# Altium project SmartHub Carrier.PrjPcb (part 1 of 2)
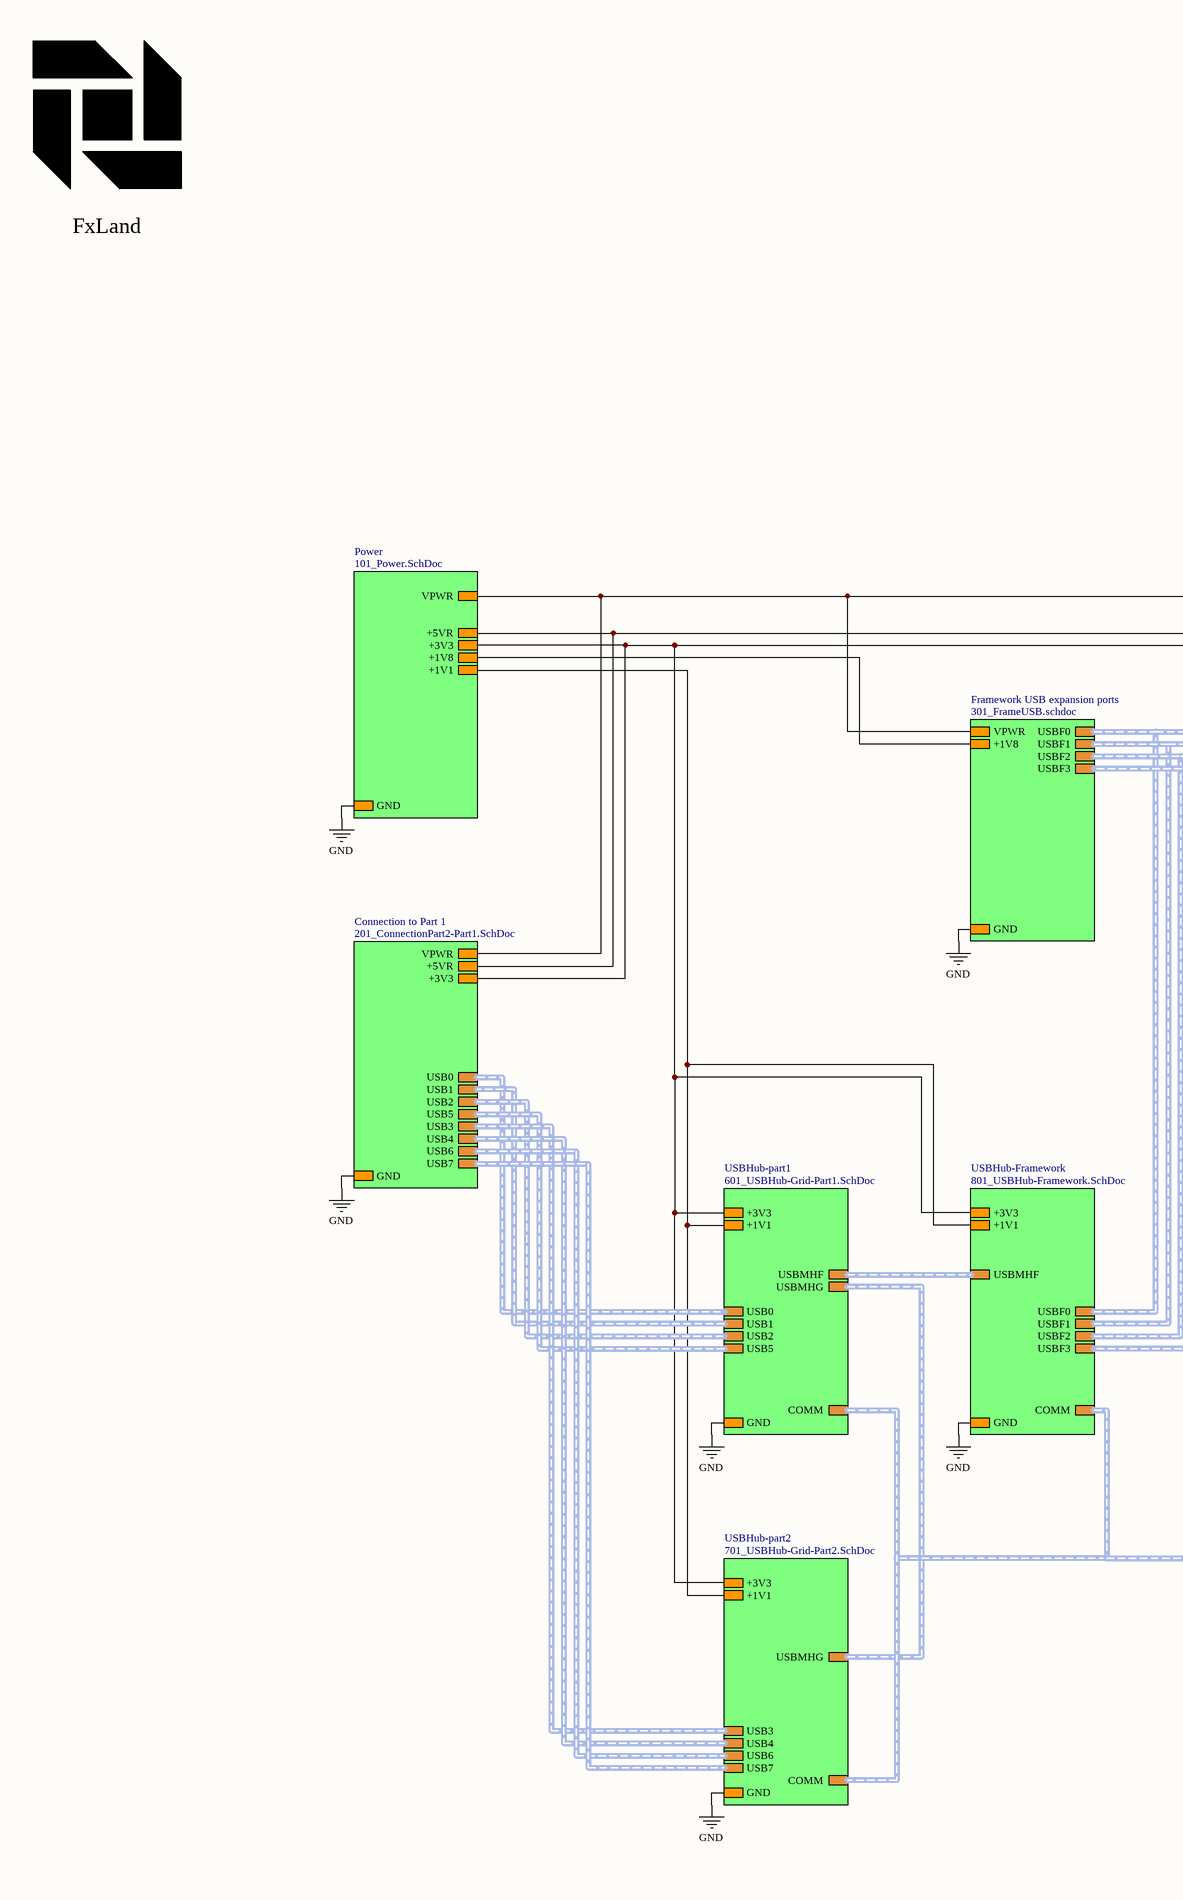
[diagram p0: 001_OverViewMainHub-part2.SchDoc, left]
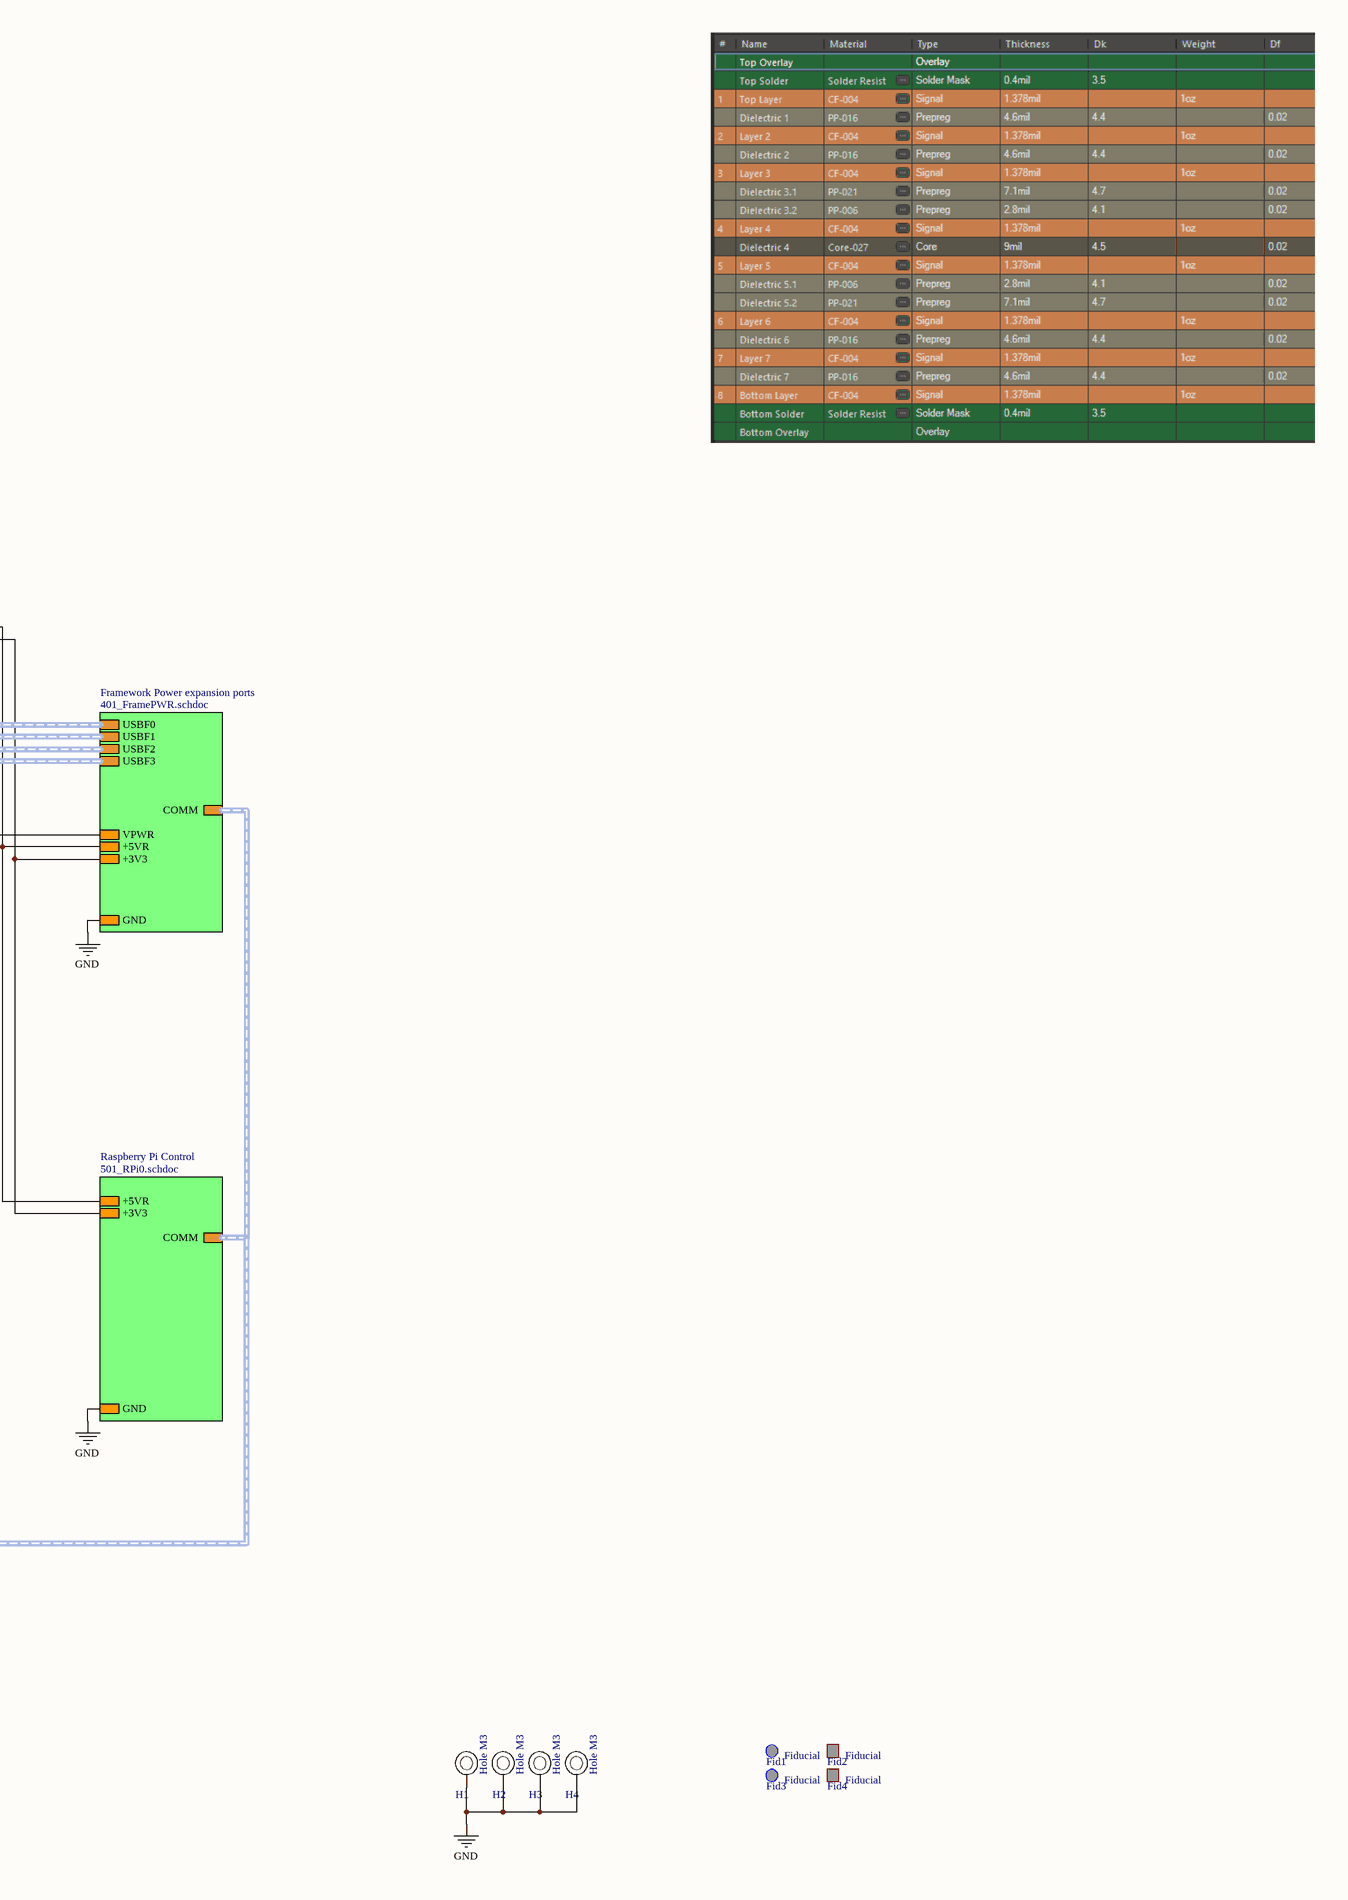
[diagram p1: 001_OverViewMainHub-part2.SchDoc, right]
DocNumber: P234; PrName: Blox MainHub Part 2; Rev: 0.6
9 sheets, 460 parts. Net scope: hierarchical (ports join the sheet entries above them; power ports are global).
Board file: SmartHub Carrier.PcbDoc
Sheets:
  001_OverViewMainHub-part2.SchDoc
    Power = 101_Power.SchDoc
    Framework USB expansion ports = 301_FrameUSB.SchDoc
    Raspberry Pi Control = 501_RPi0.SchDoc
    Framework Power expansion ports = 401_FramePWR.schdoc
    Connection to Part 1 = 201_ConnectionPart2-Part1.SchDoc
    USBHub-part1 = 601_USBHub-Grid-Part1.SchDoc
    USBHub-Framework = 801_USBHub-Framework.SchDoc
    USBHub-part2 = 701_USBHub-Grid-Part2.SchDoc

## Sheet 001_OverViewMainHub-part2.SchDoc: Overview BAS Main Hub
size A2; Organization: Greenfield Tech Solutions; Address1: Molendreef 33; Address2: Ossendrecht; Address3: 4641CS; Address4: The Netherlands; DocumentNumber: P234; Revision: 0.6; SheetNumber: 1; SheetTotal: 9

### Parts
Fid1  Fiducial  [FidR_1.0mm]
Fid2  Fiducial  [FidS_1.0mm]
Fid3  Fiducial  [FidR_1.0mm]
Fid4  Fiducial  [FidS_1.0mm]
H1  Hole M3  [HOLE_M3]
H2  Hole M3  [HOLE_M3]
H3  Hole M3  [HOLE_M3]
H4  Hole M3  [HOLE_M3]
Logo_FxLand  FxLand  [Logo_FxLand_3]  (value not drawn)

### Sub-sheets
Connection to Part 1 = 201_ConnectionPart2-Part1.SchDoc: GND, VPWR, +5VR, +3V3, USB0, USB1, USB2, USB5, USB3, USB4, USB6, USB7
Framework Power expansion ports = 401_FramePWR.schdoc: GND, VPWR, +5VR, USBF0, USBF1, USBF2, USBF3, +3V3, COMM
Framework USB expansion ports = 301_FrameUSB.schdoc: GND, VPWR, USBF0, USBF1, USBF2, USBF3, +1V8
Power = 101_Power.SchDoc: GND, VPWR, +5VR, +3V3, +1V1, +1V8
Raspberry Pi Control = 501_RPi0.schdoc: GND, +5VR, COMM, +3V3
USBHub-Framework = 801_USBHub-Framework.SchDoc: GND, USBF0, USBF1, USBF2, USBF3, USBMHF, COMM, +1V1, +3V3
USBHub-part1 = 601_USBHub-Grid-Part1.SchDoc: GND, USB0, USB1, USB2, USB5, USBMHF, USBMHG, COMM, +1V1, +3V3
USBHub-part2 = 701_USBHub-Grid-Part2.SchDoc: GND, USBMHG, USB3, USB4, USB6, USB7, COMM, +1V1, +3V3

### Nets
+1V1: sheet Power/+1V1, sheet USBHub-part1/+1V1, sheet USBHub-Framework/+1V1, sheet USBHub-part2/+1V1
+1V8: sheet Power/+1V8, sheet Framework USB expansion ports/+1V8
+3V3: sheet Power/+3V3, sheet Raspberry Pi Control/+3V3, sheet Framework Power expansion ports/+3V3, sheet Connection to Part 1/+3V3, sheet USBHub-part1/+3V3, sheet USBHub-Framework/+3V3, sheet USBHub-part2/+3V3
+5VR: sheet Power/+5VR, sheet Raspberry Pi Control/+5VR, sheet Framework Power expansion ports/+5VR, sheet Connection to Part 1/+5VR
GND: H1.1 H2.1 H3.1 H4.1 ; sheet Power/GND, sheet Framework USB expansion ports/GND, sheet Raspberry Pi Control/GND, sheet Framework Power expansion ports/GND, sheet Connection to Part 1/GND, sheet USBHub-part1/GND, sheet USBHub-Framework/GND, sheet USBHub-part2/GND
VPWR: sheet Power/VPWR, sheet Framework USB expansion ports/VPWR, sheet Framework Power expansion ports/VPWR, sheet Connection to Part 1/VPWR

### Buses and harness runs
harness sheet Connection to Part 1/USB0 = sheet USBHub-part1/USB0
harness sheet Connection to Part 1/USB1 = sheet USBHub-part1/USB1
harness sheet Connection to Part 1/USB2 = sheet USBHub-part1/USB2
harness sheet Connection to Part 1/USB3 = sheet USBHub-part2/USB3
harness sheet Connection to Part 1/USB4 = sheet USBHub-part2/USB4
harness sheet Connection to Part 1/USB5 = sheet USBHub-part1/USB5
harness sheet Connection to Part 1/USB6 = sheet USBHub-part2/USB6
harness sheet Connection to Part 1/USB7 = sheet USBHub-part2/USB7
harness sheet Framework Power expansion ports/COMM = sheet Raspberry Pi Control/COMM = sheet USBHub-Framework/COMM = sheet USBHub-part1/COMM = sheet USBHub-part2/COMM
harness sheet Framework Power expansion ports/USBF0 = sheet Framework USB expansion ports/USBF0 = sheet USBHub-Framework/USBF0
harness sheet Framework Power expansion ports/USBF1 = sheet Framework USB expansion ports/USBF1 = sheet USBHub-Framework/USBF1
harness sheet Framework Power expansion ports/USBF2 = sheet Framework USB expansion ports/USBF2 = sheet USBHub-Framework/USBF2
harness sheet Framework Power expansion ports/USBF3 = sheet Framework USB expansion ports/USBF3 = sheet USBHub-Framework/USBF3
harness sheet USBHub-Framework/USBMHF = sheet USBHub-part1/USBMHF
harness sheet USBHub-part1/USBMHG = sheet USBHub-part2/USBMHG

### Notes on the sheet
- Title
- Size:
- Date:
- File:
- A2
- Number:
- Time:
- Revision:
- Sheet
- of

### Library data of the parts
Fid1 Fid3 = ME0011: Fiducial Round 1mm; Part Number: ME0011; ID: 11; RefVal: Fiducial
Fid2 Fid4 = ME0012: Fiducial Sqaure 1mm; Part Number: ME0012; ID: 12; RefVal: Fiducial
H1-H4 = ME0001: Mounting Hole M3; Part Number: ME0001; ID: 1; RefVal: Hole M3
Logo_FxLand = ME0008: Logo FxLand 3; Part Number: ME0008; ID: 8; RefVal: FxLand

## Sheet 101_Power.SchDoc: Power MainHub Part 2
size A2; Organization: Greenfield Tech Solutions; Address1: Molendreef 33; Address2: Ossendrecht; Address3: 4641CS; Address4: The Netherlands; DocumentNumber: P234; Revision: 0.6; SheetNumber: 2; SheetTotal: 9
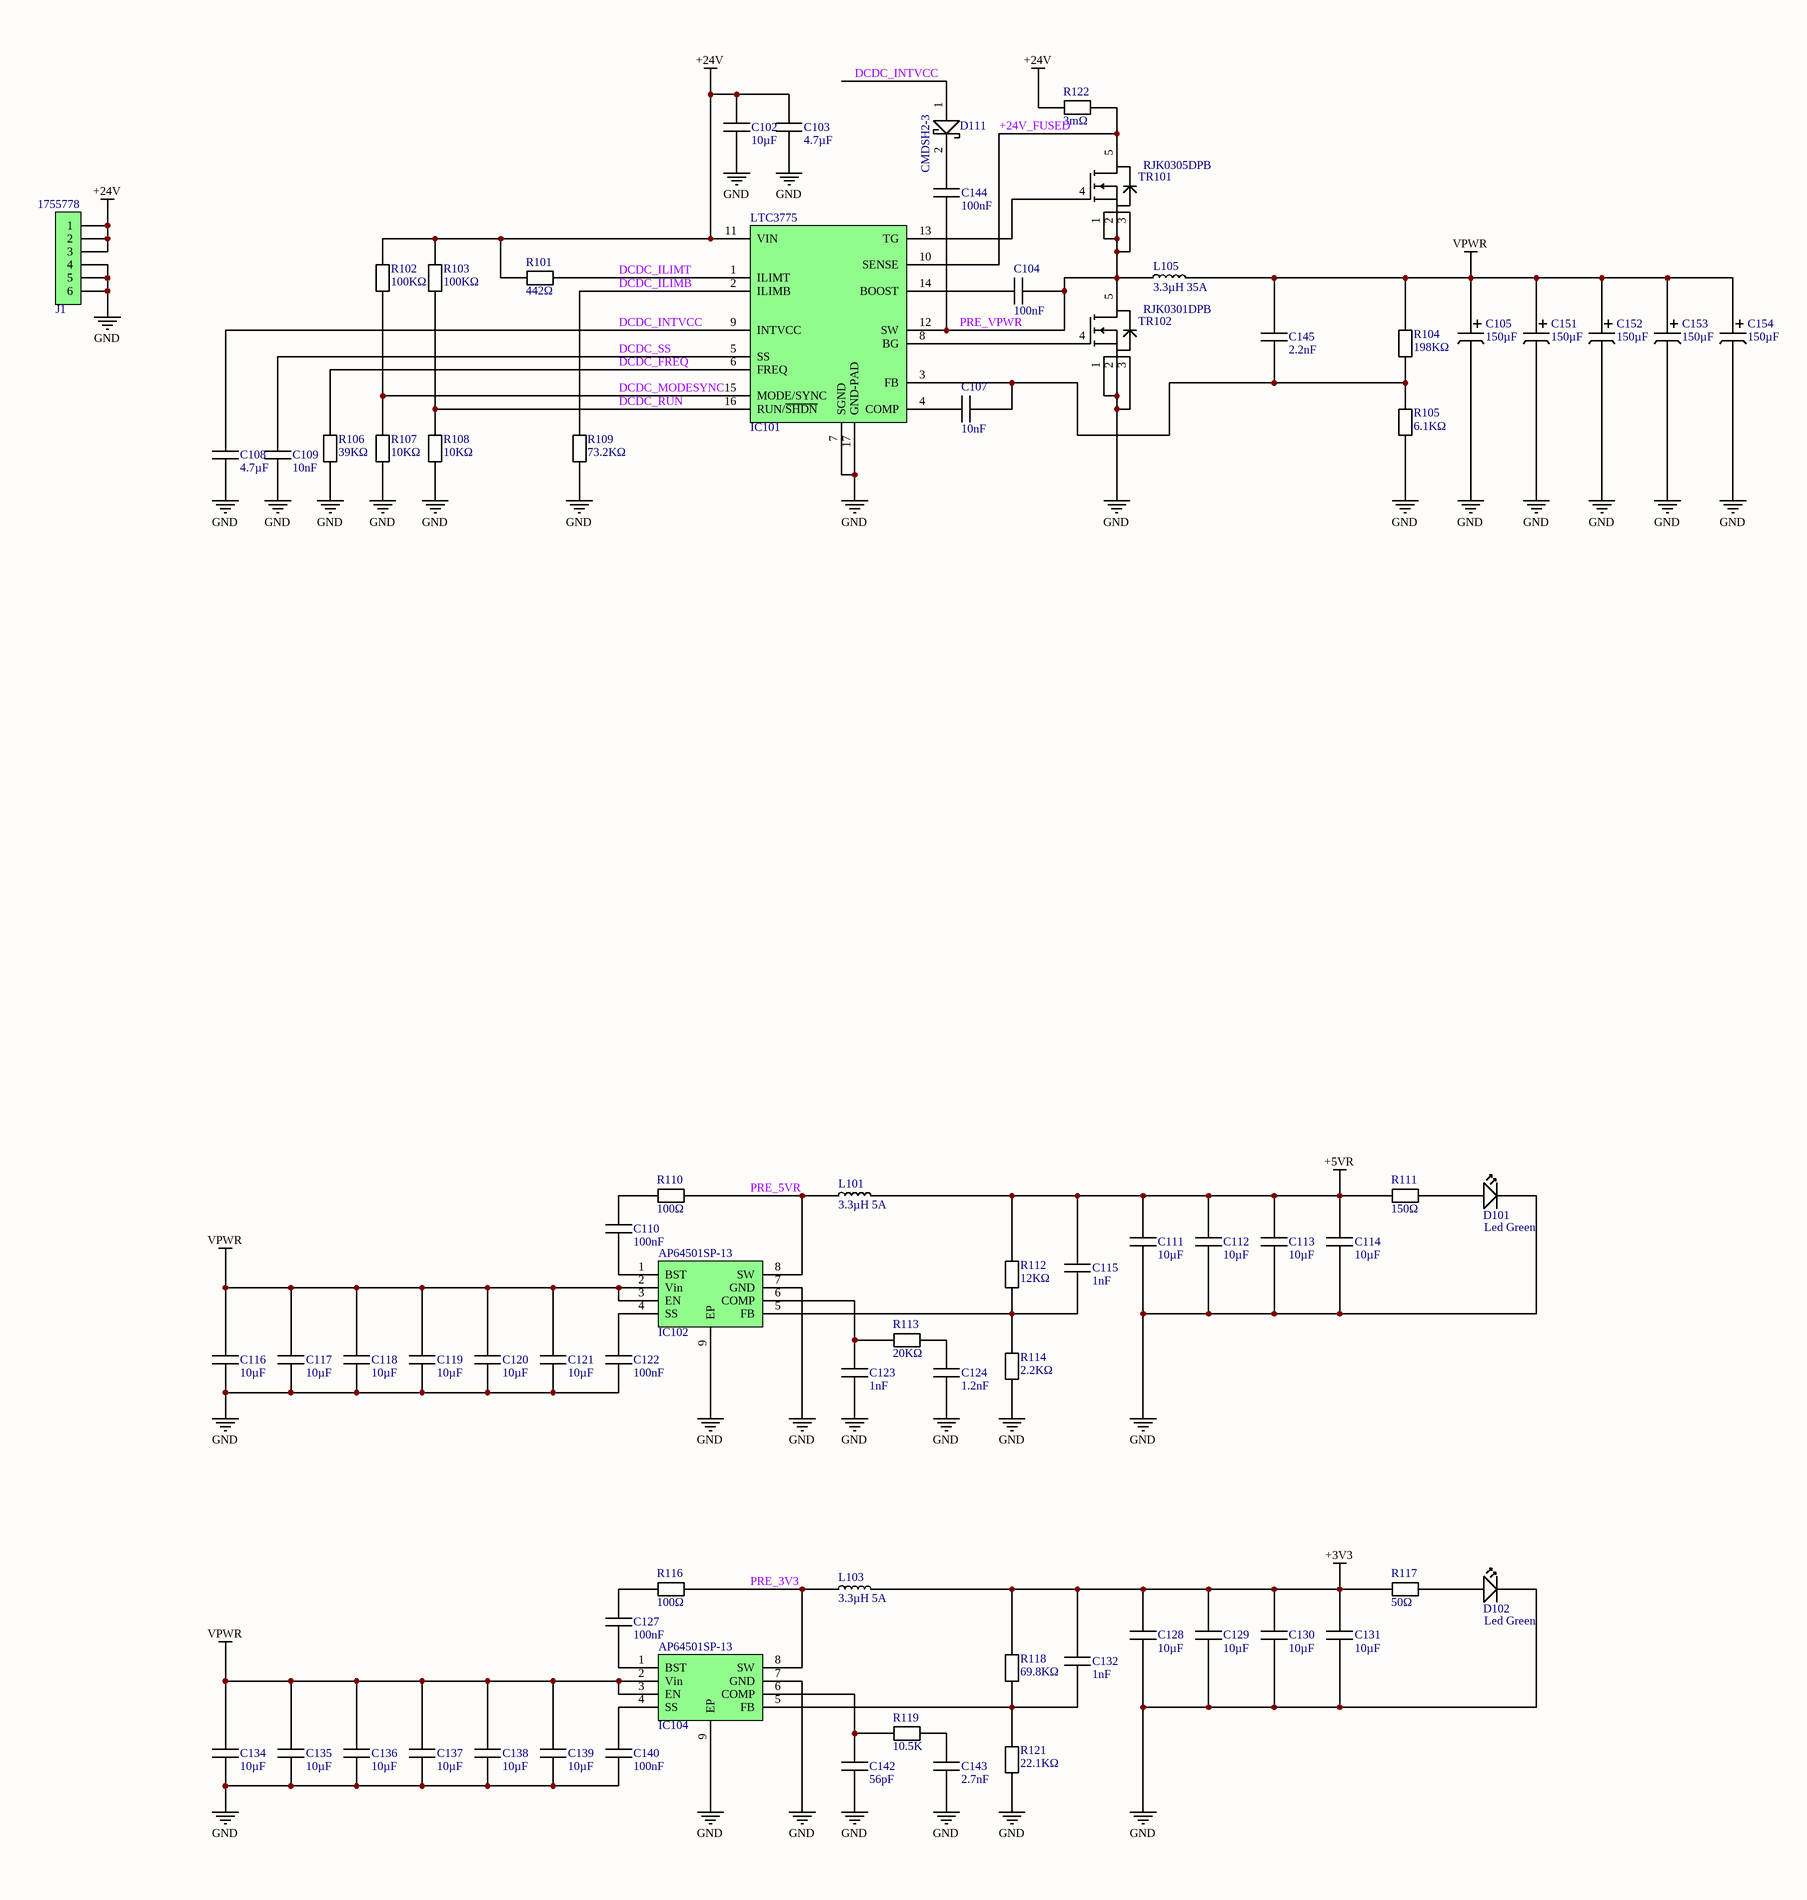
[diagram p2: 101_Power.SchDoc, left]
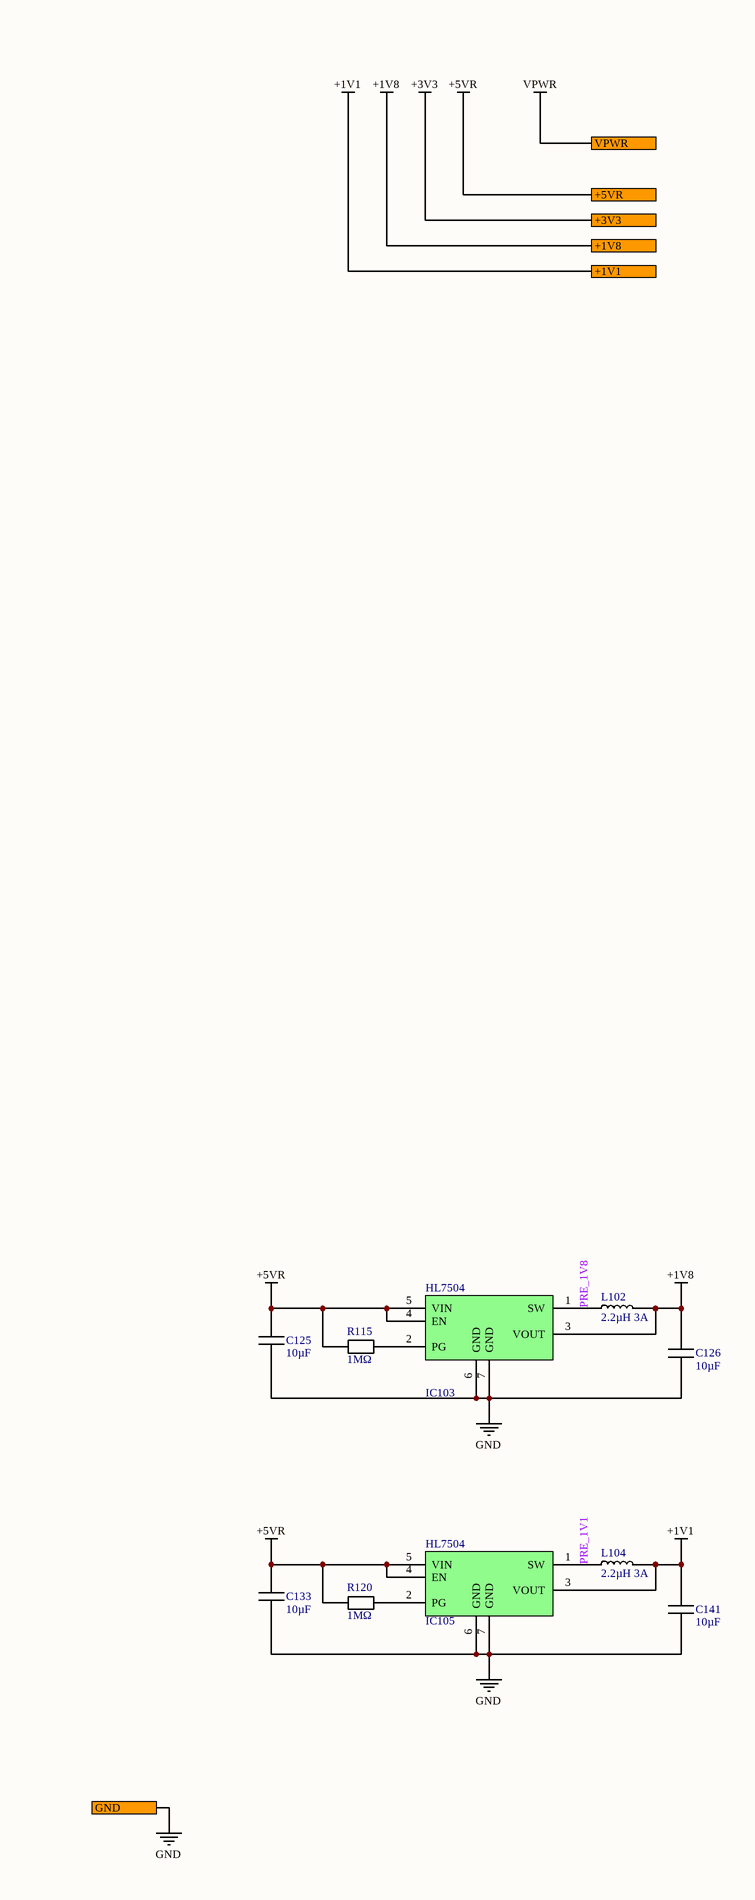
[diagram p3: 101_Power.SchDoc, right]

### Parts
C102  10µF  [C1210]
C103  4.7µF  [C1210]
C104  100nF  [C0402]
C105  150µF  [Tantalum_2924_4.1MM]
C107  10nF  [C0805]
C108  4.7µF  [C1210]
C109  10nF  [C0805]
C110  100nF  [C0402]
C111  10µF  [C0805]
C112  10µF  [C0805]
C113  10µF  [C0805]
C114  10µF  [C0805]
C115  1nF  [C0402]
C116  10µF  [C0805]
C117  10µF  [C0805]
C118  10µF  [C0805]
C119  10µF  [C0805]
C120  10µF  [C0805]
C121  10µF  [C0805]
C122  100nF  [C0402]
C123  1nF  [C0402]
C124  1.2nF  [C0402]
C125  10µF  [C0603]
C126  10µF  [C0603]
C127  100nF  [C0402]
C128  10µF  [C0805]
C129  10µF  [C0805]
C130  10µF  [C0805]
C131  10µF  [C0805]
C132  1nF  [C0402]
C133  10µF  [C0603]
C134  10µF  [C0805]
C135  10µF  [C0805]
C136  10µF  [C0805]
C137  10µF  [C0805]
C138  10µF  [C0805]
C139  10µF  [C0805]
C140  100nF  [C0402]
C141  10µF  [C0603]
C142  56pF  [C0402]
C143  2.7nF  [C0402]
C144  100nF  [C0402]
C145  2.2nF  [C0805]
C151  150µF  [Tantalum_2924_4.1MM]
C152  150µF  [Tantalum_2924_4.1MM]
C153  150µF  [Tantalum_2924_4.1MM]
C154  150µF  [Tantalum_2924_4.1MM]
D101  Led Green  [Led0805]
D102  Led Green  [Led0805]
D111  CMDSH2-3  [SOD-323]
IC101  LTC3775  [QFN-16G_3X3]
IC102  AP64501SP-13  [SO-8-EP]
IC103  HL7504  [DFN-6G_2X2]
IC104  AP64501SP-13  [SO-8-EP]
IC105  HL7504  [DFN-6G_2X2]
J1  1755778  [1755778]
L101  3.3µH 5A  [SRN6045TA]
L102  2.2µH 3A  [NRS4018]
L103  3.3µH 5A  [SRN6045TA]
L104  2.2µH 3A  [NRS4018]
L105  3.3µH 35A  [IN-2P_17X17]
R101  442Ω  [R0402]
R102  100KΩ  [R0402]
R103  100KΩ  [R0402]
R104  198KΩ  [R0603]
R105  6.1KΩ  [R0402]
R106  39KΩ  [R0402]
R107  10KΩ  [R0402]
R108  10KΩ  [R0402]
R109  73.2KΩ  [R0402]
R110  100Ω  [R0603]
R111  150Ω  [R0603]
R112  12KΩ  [R0402]
R113  20KΩ  [R0402]
R114  2.2KΩ  [R0402]
R115  1MΩ  [R0402]
R116  100Ω  [R0603]
R117  50Ω  [R0603]
R118  69.8KΩ  [R0603]
R119  10.5K  [R0402]
R120  1MΩ  [R0402]
R121  22.1KΩ  [R0603]
R122  3mΩ  [R1206]
TR101  RJK0305DPB  [LFPAK-5_4.9X4]
TR102  RJK0301DPB  [LFPAK-5_4.9X4]

### Ports
+1V1, +1V8, +3V3, +5VR, GND, VPWR

### Nets
+1V1: C141.1 IC105.3(VOUT) L104.2 ; port +1V1
+1V8: C126.1 IC103.3(VOUT) L102.2 ; port +1V8
+3V3: C128.1 C129.1 C130.1 C131.1 C132.1 L103.2 R117.1 R118.2 ; port +3V3
+5VR: C111.1 C112.1 C113.1 C114.1 C115.1 C125.1 C133.1 IC103.4(EN) IC103.5(VIN) IC105.4(EN) IC105.5(VIN) L101.2 R111.1 R112.2 R115.1 R120.1 ; port +5VR
+24V: C102.1 C103.1 IC101.11(VIN) J1.1 J1.2 J1.3 R101.2 R102.2 R103.2 R122.1
GND: C102.2 C103.2 C105.2 C108.2 C109.2 C111.2 C112.2 C113.2 C114.2 C116.2 C117.2 C118.2 C119.2 C120.2 C121.2 C122.2 C123.2 C124.2 C125.2 C126.2 C128.2 C129.2 C130.2 C131.2 C133.2 C134.2 C135.2 C136.2 C137.2 C138.2 C139.2 C140.2 C141.2 C142.2 C143.2 C151.2 C152.2 C153.2 C154.2 D101.K D102.K IC101.7(SGND) IC101.17(GND-PAD) IC102.7(GND) IC102.9(EP) IC103.6(GND) IC103.7(GND) IC104.7(GND) IC104.9(EP) IC105.6(GND) IC105.7(GND) J1.4 J1.5 J1.6 R105.1 R106.1 R107.1 R108.1 R109.1 R114.1 R121.1 TR102.1(S) TR102.2(S) TR102.3(S) ; port GND
VPWR: C105.1 C116.1 C117.1 C118.1 C119.1 C120.1 C121.1 C134.1 C135.1 C136.1 C137.1 C138.1 C139.1 C145.1 C151.1 C152.1 C153.1 C154.1 IC102.2(Vin) IC102.3(EN) IC104.2(Vin) IC104.3(EN) L105.2 R104.2 ; port VPWR
+24V_FUSED: IC101.10(SENSE) R122.2 TR101.5(D)
DCDC_FREQ: IC101.6(FREQ) R106.2
DCDC_ILIMB: IC101.2(ILIMB) R109.2
DCDC_ILIMT: IC101.1(ILIMT) R101.1
DCDC_INTVCC: C108.1 D111.1(A) IC101.9(INTVCC)
DCDC_MODESYNC: IC101.15(MODE/SYNC) R102.1 R107.2
DCDC_RUN: IC101.16(RUN/~{SHDN}) R103.1 R108.2
DCDC_SS: C109.1 IC101.5(SS)
PRE_1V1: IC105.1(SW) L104.1
PRE_1V8: IC103.1(SW) L102.1
PRE_3V3: IC104.8(SW) L103.1 R116.2
PRE_5VR: IC102.8(SW) L101.1 R110.2
PRE_VPWR: C104.2 C144.2 IC101.12(SW) L105.1 TR101.1(S) TR101.2(S) TR101.3(S) TR102.5(D)
NetC104_1: C104.1 IC101.14(BOOST)
NetC107_1: C107.1 IC101.4(COMP)
NetC107_2: C107.2 C145.2 IC101.3(FB) R104.1 R105.2
NetC110_1: C110.1 R110.1
NetC110_2: C110.2 IC102.1(BST)
NetC115_2: C115.2 IC102.5(FB) R112.1 R114.2
NetC122_1: C122.1 IC102.4(SS)
NetC123_1: C123.1 IC102.6(COMP) R113.2
NetC124_1: C124.1 R113.1
NetC127_1: C127.1 R116.1
NetC127_2: C127.2 IC104.1(BST)
NetC132_2: C132.2 IC104.5(FB) R118.1 R121.2
NetC140_1: C140.1 IC104.4(SS)
NetC142_1: C142.1 IC104.6(COMP) R119.2
NetC143_1: C143.1 R119.1
NetC144_1: C144.1 D111.2(K)
NetD101_A: D101.A R111.2
NetD102_A: D102.A R117.2
NetIC101_8: IC101.8(BG) TR102.4(G)
NetIC101_13: IC101.13(TG) TR101.4(G)
NetIC103_2: IC103.2(PG) R115.2
NetIC105_2: IC105.2(PG) R120.2

### Notes on the sheet
- Title
- Size:
- Date:
- File:
- A2
- Number:
- Time:
- Revision:
- Sheet
- of

### Library data of the parts
C102 = CA0024: 10µF 63V 10% X7R; Part Number: CA0024; ManfactPart: GRM32ER71J106KA12; ID: 24; RefVal: 10µF
C103 C108 = CA0038: 4.7µF 100V 10% X5R; Part Number: CA0038; ManfactPart: HMK325BJ475KM-PE; ID: 38; RefVal: 4.7µF
C104 C110 C122 C127 C140 C144 = CA0029: 100nF 50V 10% X7R; Part Number: CA0029; ManfactPart: CGA2B3X7R1H104K050BB; ID: 29; RefVal: 100nF
C105 C151-C154 = CA0076: 150µF 35V 20% 100mΩ; Part Number: CA0076; ManfactPart: TCJU157M035R0100E; ID: 76; RefVal: 150µF
C107 C109 = CA0021: 10nF 50V 10% X7R; Part Number: CA0021; ManfactPart: C0805C103K5RAC; ID: 21; RefVal: 10nF
C111-C114 C128-C131 = CA0001: 10µF 16V 10% X5R; Part Number: CA0001; ManfactPart: GRM21BR61C106KE15L; ID: 1; RefVal: 10µF
C115 C123 C132 = CA0031: 1nF 50V 1% C0G; Part Number: CA0031; ManfactPart: GRT1555C1H102FA02D; ID: 31; RefVal: 1nF
C116-C121 C134-C139 = CA0005: 10µF 35V 10% X5R; Part Number: CA0005; ManfactPart: C2012X5R1V106K125AC; ID: 5; RefVal: 10µF
C124 = CA0030: 1.2nF 50V 10% X7R; Part Number: CA0030; ManfactPart: GCM155R71H122KA37D; ID: 30; RefVal: 1.2nF
C125 C126 C133 C141 = CA0008: 10µF 16V 20% X5R; Part Number: CA0008; ManfactPart: GRM188R61C106MAALD; ID: 8; RefVal: 10µF
C142 = CA0068: 56pF 50V 2% C0G; Part Number: CA0068; ManfactPart: CC0402GRNPO9BN560; ID: 68; RefVal: 56pF
C143 = CA0055: 2.7nF 50V 5% X7R; Part Number: CA0055; ManfactPart: GRM155R71H272JA01D; ID: 55; RefVal: 2.7nF
C145 = CA0070: 2.2nF 50V 10% X7R; Part Number: CA0070; ManfactPart: C0805C222K5RAC; ID: 70; RefVal: 2.2nF
D101 D102 = DI0001: Part Number: DI0001; ManfactPart: KP-2012CGCK; ID: 1; RefVal: Led Green
D111 = DI0013: Schottky Diodes 30V; Part Number: DI0013; ManfactPart: CMDSH2-3 TR PBFREE; ID: 13; RefVal: CMDSH2-3
IC101 = IC0063: High Frequency Synchronous Step-Down Voltage Mode DC/DC Controller; Part Number: IC0063; ManfactPart: LTC3775IUD#PBF; ID: 63; RefVal: LTC3775
IC102 IC104 = IC0031: 3.8V TO 40V INPUT, 5A LOW IQ SYNCHRONOUS BUCK WITH PROGRAMMABLE SOFT-START TIME; Part Number: IC0031; ID: 31; RefVal: AP64501SP-13; ManfactPart: AP64501SP-13
IC103 = IC0064: 3MHz 2A Buck Converter 1.80V OUT; Part Number: IC0064; ManfactPart: HL7504FN07; ID: 64; RefVal: HL7504
IC105 = IC0050: 3MHz 2A Buck Converter 1.10V OUT; Part Number: IC0050; ManfactPart: HL7504FN08; ID: 50; RefVal: HL7504
J1 = CO0033: Pluggable Terminal Blocks 6 Pos 5.08mm pitch Through Hole Header; Part Number: CO0033; ID: 33; RefVal: 1755778; ManfactPart: 1755778
L101 L103 = IN0005: 3.3µH 5A 30% 21mΩ; Part Number: IN0005; ManfactPart: SRN6045TA-3R3Y; ID: 5; RefVal: 3.3µH 5A
L102 L104 = IN0004: Part Number: IN0004; ManfactPart: NRS4018T2R2MDGJ; ID: 4; RefVal: 2.2µH 3A
L105 = IN0018: 3.3µH 35A 20% 2.93mΩ; Part Number: IN0018; ManfactPart: IHLP6767GZER3R3M11; ID: 18; RefVal: 3.3µH 35A
R101 = RS0083: 442Ω 1% 100mW 100PPM; Part Number: RS0083; ManfactPart: ERJ-2RKF4420X; ID: 83; RefVal: 442Ω
R102 R103 = RS0036: 100KΩ 1% 62.5mW 100PPM; Part Number: RS0036; ManfactPart: AC0402FR-13100KL; ID: 36; RefVal: 100KΩ
R104 = RS0088: 198KΩ 0.1% 100mW 25PPM; Part Number: RS0088; ManfactPart: RT0603BRD07198KL; ID: 88; RefVal: 198KΩ
R105 = RS0084: 6.1KΩ 0.1% 100mW 25PPM; Part Number: RS0084; ManfactPart: TNPW040236K1BEED; ID: 84; RefVal: 6.1KΩ
R106 = RS0089: 39KΩ 1% 62.5mW 100PPM; Part Number: RS0089; ManfactPart: CRG0402F39K; ID: 89; RefVal: 39KΩ
R107 R108 = RS0011: 10KΩ 1% 62.5mW; Part Number: RS0011; ManfactPart: WR04X1002FTL; ID: 11; RefVal: 10KΩ
R109 = RS0090: 73.2KΩ 1% 100mW 100PPM; Part Number: RS0090; ManfactPart: RK73H1ETTP7322F; ID: 90; RefVal: 73.2KΩ
R110 R116 = RS0007: 100Ω 1% 100mW; Part Number: RS0007; ManfactPart: WR06X1000FTL; ID: 7; RefVal: 100Ω
R111 = RS0001: 150Ω 1% 100mW; Part Number: RS0001; ManfactPart: MCWR06X1500FTL; ID: 1; RefVal: 150Ω
R112 = RS0015: 12KΩ 1% 62.5mW; Part Number: RS0015; ManfactPart: RC0402FR-1312KL; ID: 15; RefVal: 12KΩ
R113 = RS0034: 20KΩ 1% 100mW 100PPM; Part Number: RS0034; ManfactPart: ERJ-S02F2002X; ID: 34; RefVal: 20KΩ
R114 = RS0035: 2.2KΩ 1% 62.5mW 100PPM; Part Number: RS0035; ManfactPart: CRGCQ0402F2K2; ID: 35; RefVal: 2.2KΩ
R115 R120 = RS0066: 1MΩ 1% 62.5mW 100PPM; Part Number: RS0066; ManfactPart: 0402WGF1004TCE; ID: 66; RefVal: 1MΩ
R117 = RS0080: 50Ω 0.1% 100mW 50PPM; Part Number: RS0080; ManfactPart: RT0603BRE0750RL; ID: 80; RefVal: 50Ω
R118 = RS0041: 69.8KΩ 1% 100mW 100PPM; Part Number: RS0041; ManfactPart: CRCW060369K8FKEB; ID: 41; RefVal: 69.8KΩ
R119 = RS0054: 10.5KΩ 1% 62.5mW 100PPM; Part Number: RS0054; ManfactPart: CRCW040210K5FKEDC; ID: 54; RefVal: 10.5K
R121 = RS0040: 22.1KΩ 1% 100mW 100PPM; Part Number: RS0040; ManfactPart: RC0603FR-0722K1L; ID: 40; RefVal: 22.1KΩ
R122 = RS0091: 3mΩ 5% 250mW 100PPM; Part Number: RS0091; ManfactPart: AC1206JR-073ML; ID: 91; RefVal: 3mΩ
TR101 = TR0015: 30V/8mΩ, N-channel Power MOSFET, 30A; Part Number: TR0015; ID: 15; RefVal: RJK0305DPB; ManfactPart: RJK0305DPB
TR102 = TR0014: 30V/2.8mΩ, N-channel Power MOSFET, 60A; Part Number: TR0014; ID: 14; RefVal: RJK0301DPB; ManfactPart: RJK0301DPB

## Sheet 301_FrameUSB.SchDoc: Framework USB Expansion Ports
size A2; Organization: Greenfield Tech Solutions; Address1: Molendreef 33; Address2: Ossendrecht; Address3: 4641CS; Address4: The Netherlands; DocumentNumber: P234; Revision: 0.6; SheetNumber: 4; SheetTotal: 9
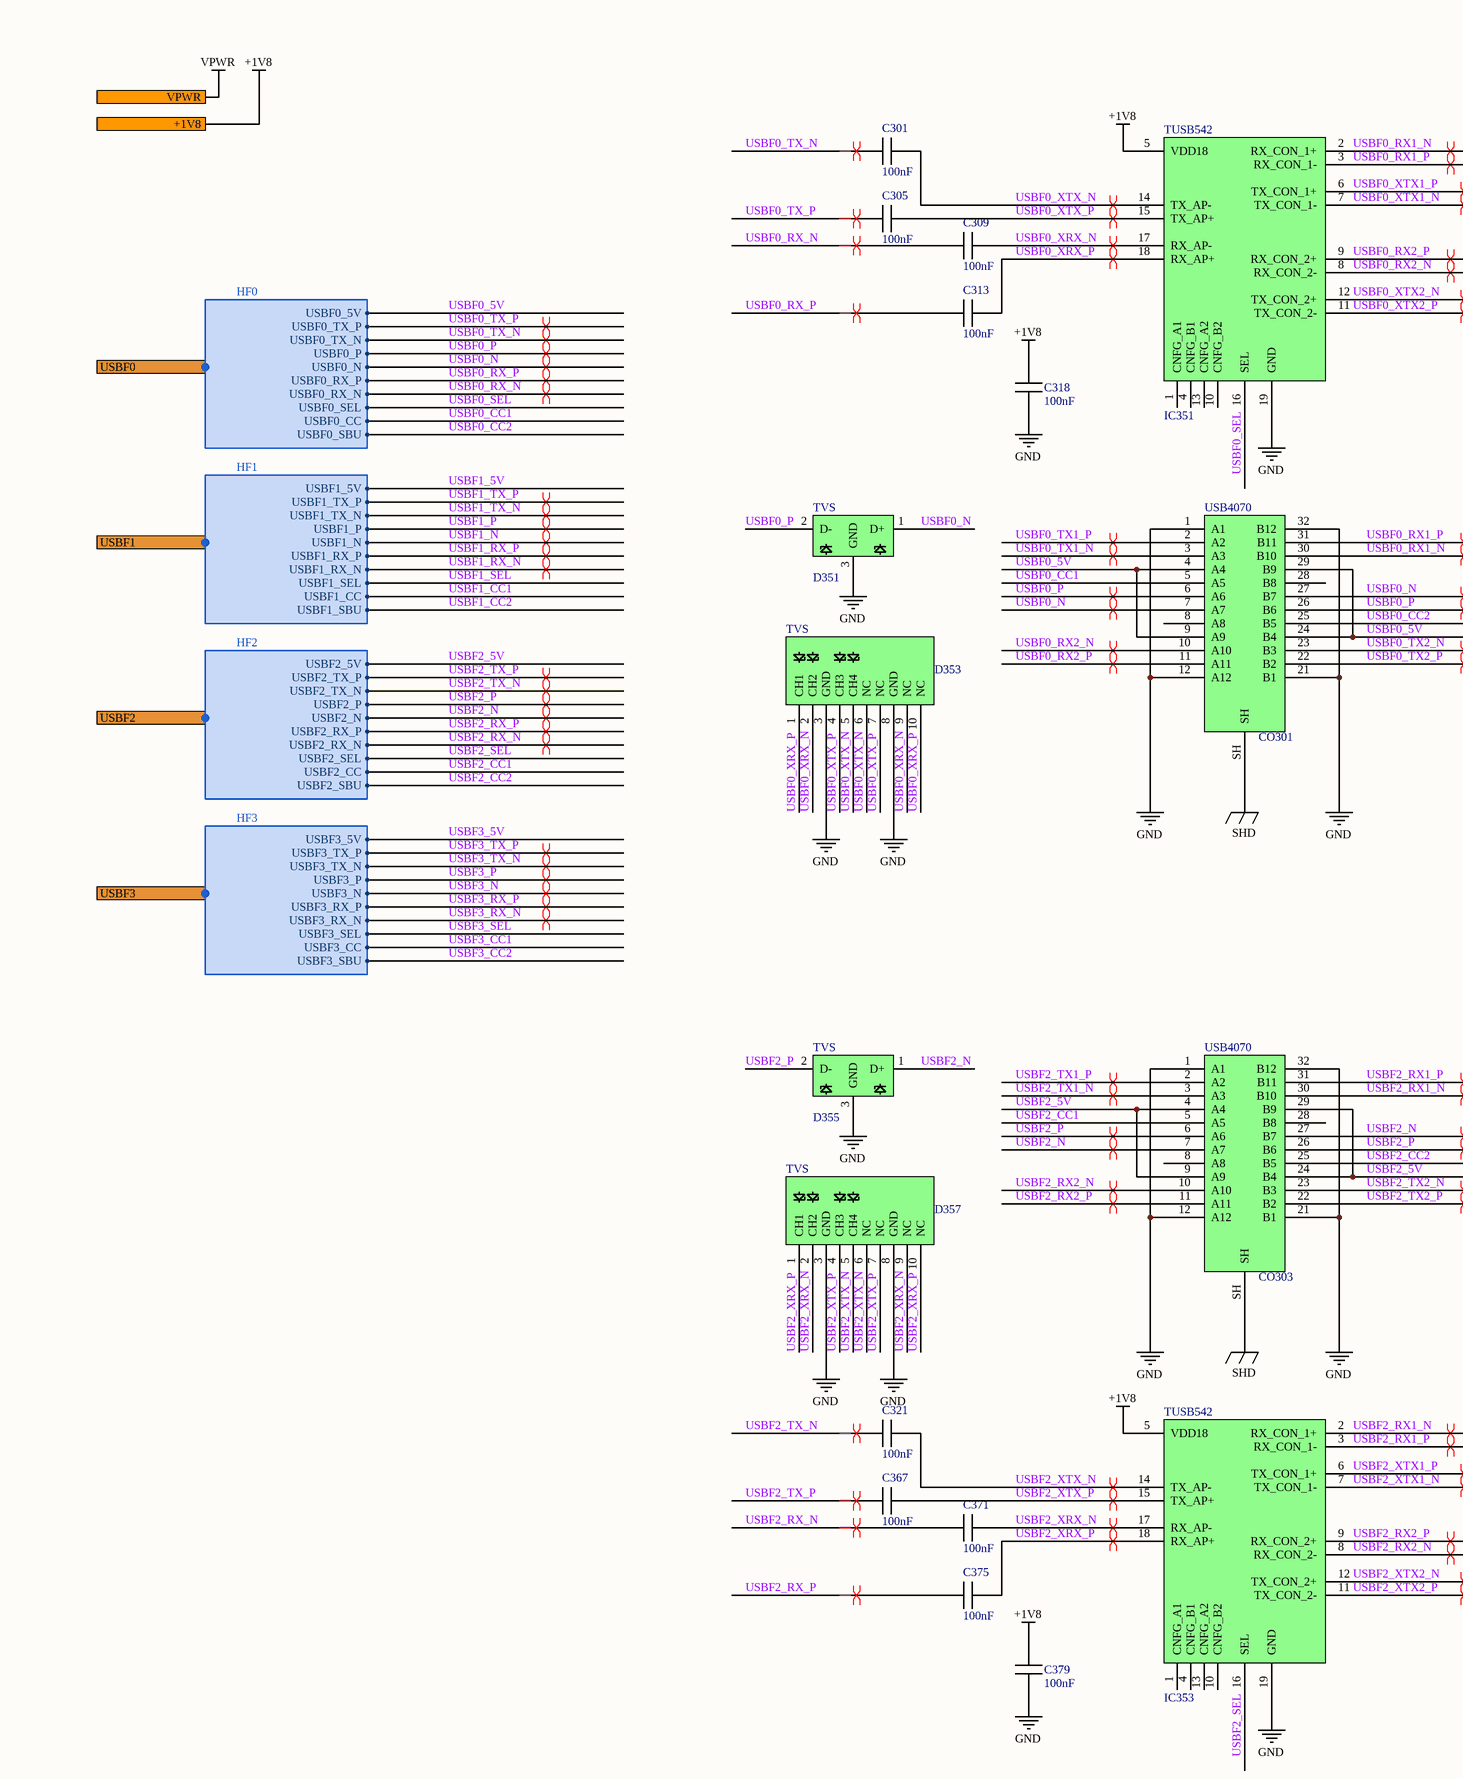
[diagram p4: 301_FrameUSB.SchDoc, top left]
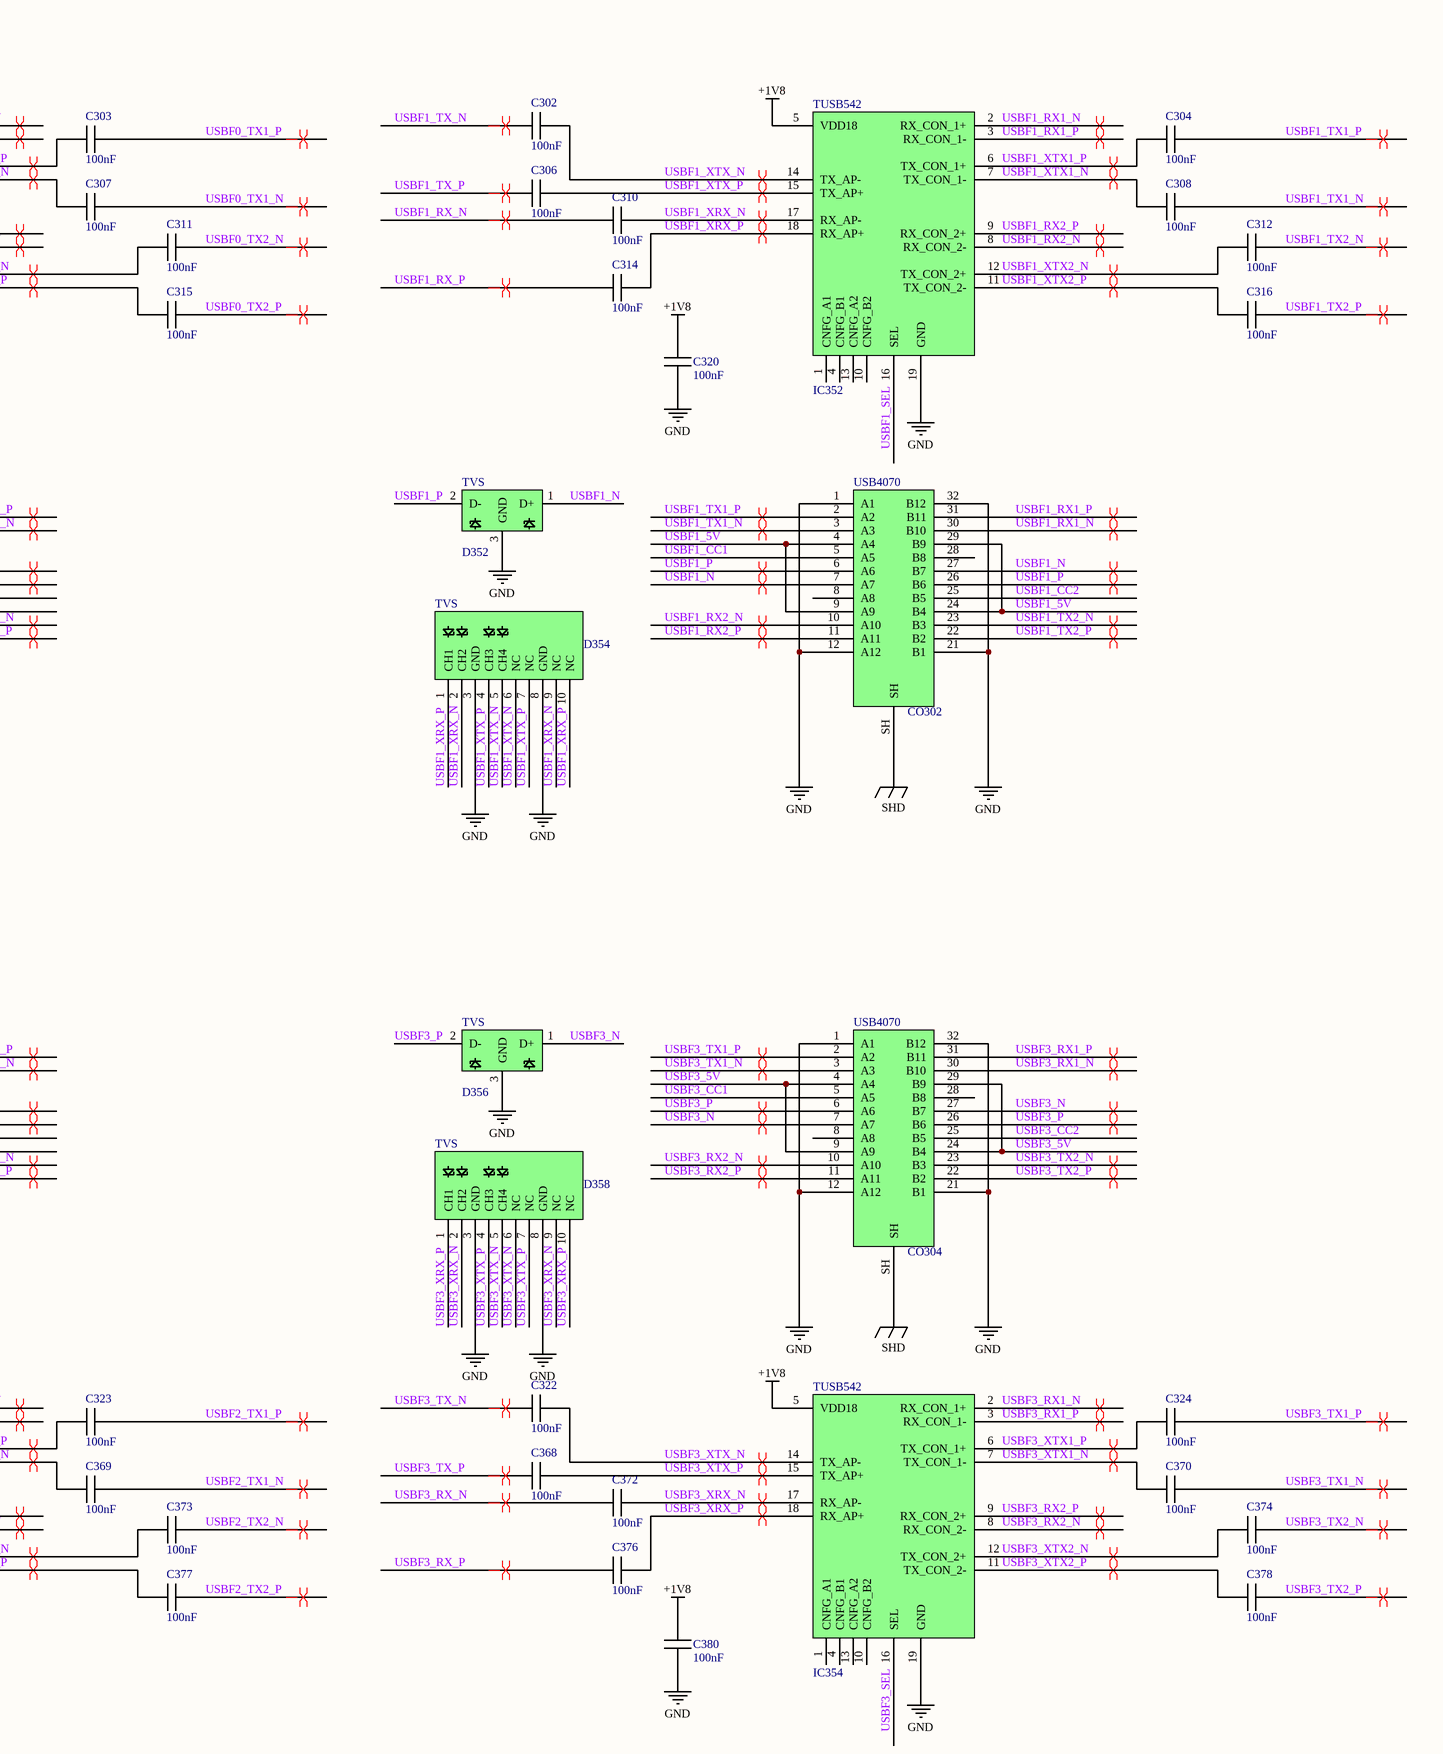
[diagram p5: 301_FrameUSB.SchDoc, top right]
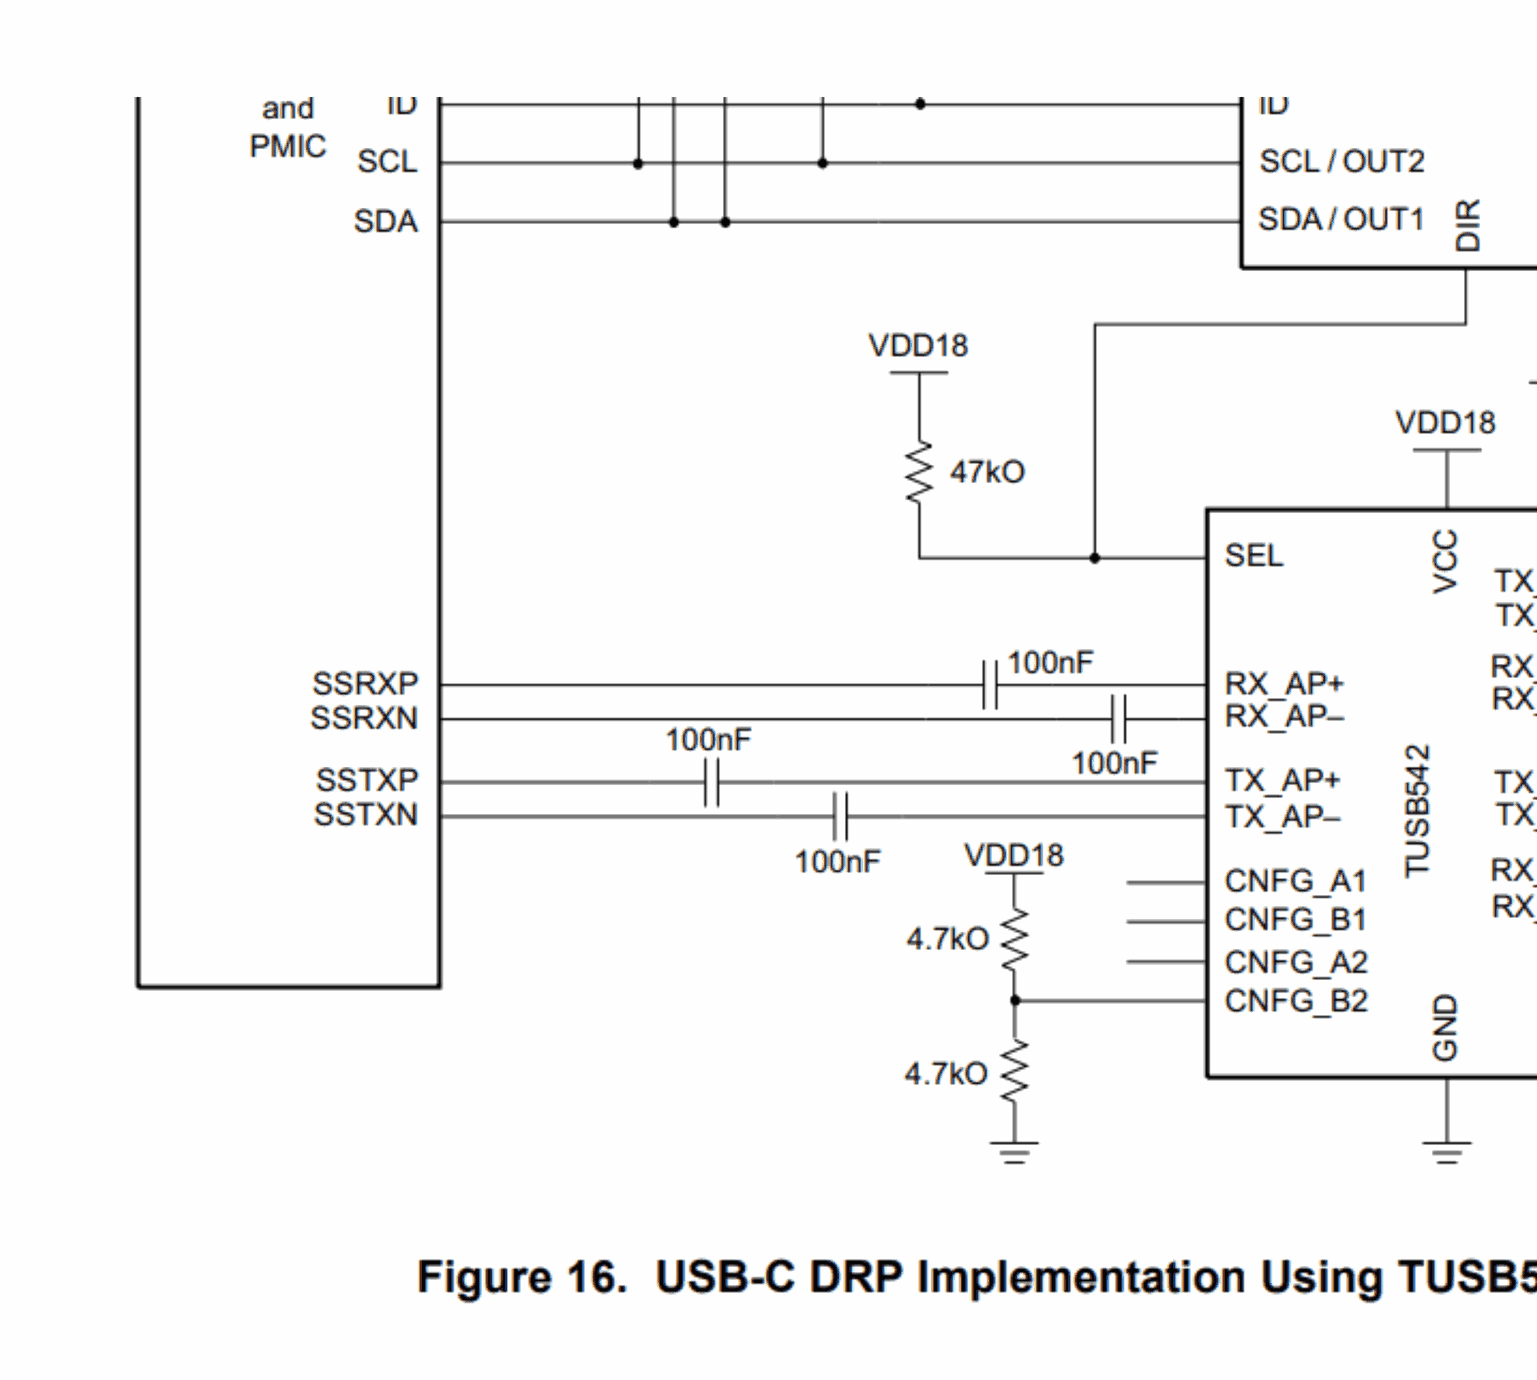
[diagram p6: 301_FrameUSB.SchDoc, bottom left]
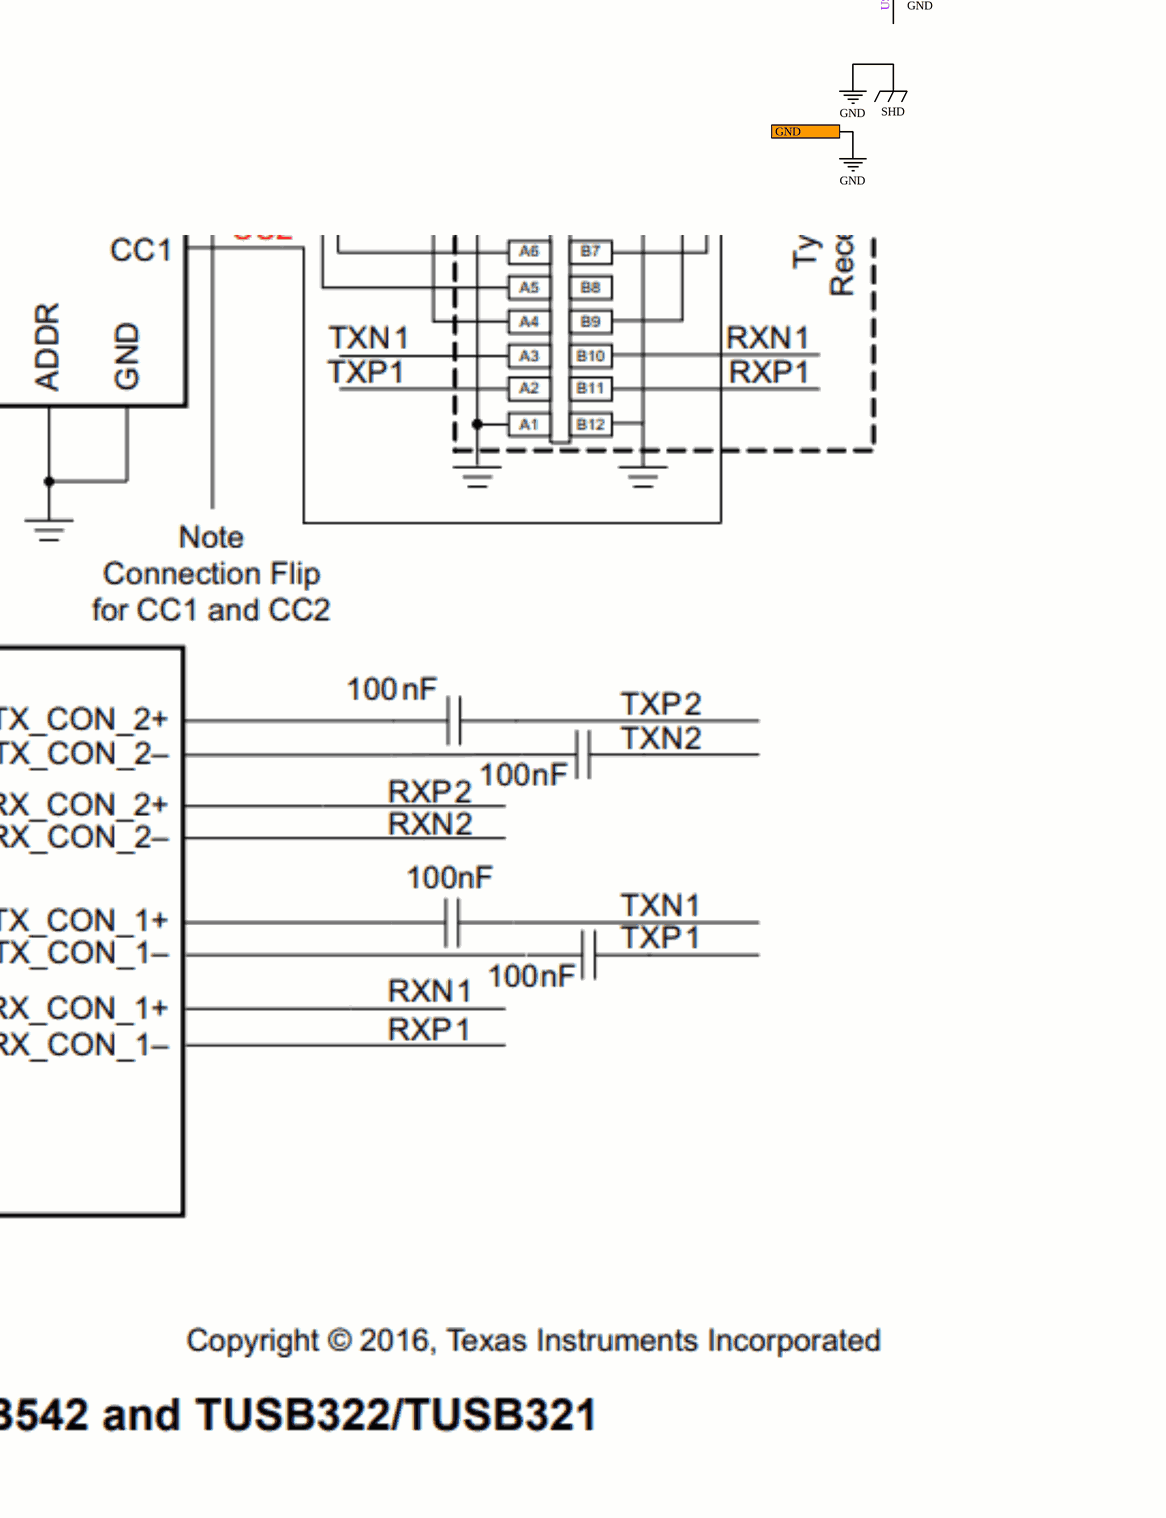
[diagram p7: 301_FrameUSB.SchDoc, bottom right]

### Parts
C301  100nF  [C0402]
C302  100nF  [C0402]
C303  100nF  [C0402]
C304  100nF  [C0402]
C305  100nF  [C0402]
C306  100nF  [C0402]
C307  100nF  [C0402]
C308  100nF  [C0402]
C309  100nF  [C0402]
C310  100nF  [C0402]
C311  100nF  [C0402]
C312  100nF  [C0402]
C313  100nF  [C0402]
C314  100nF  [C0402]
C315  100nF  [C0402]
C316  100nF  [C0402]
C318  100nF  [C0402]
C320  100nF  [C0402]
C321  100nF  [C0402]
C322  100nF  [C0402]
C323  100nF  [C0402]
C324  100nF  [C0402]
C367  100nF  [C0402]
C368  100nF  [C0402]
C369  100nF  [C0402]
C370  100nF  [C0402]
C371  100nF  [C0402]
C372  100nF  [C0402]
C373  100nF  [C0402]
C374  100nF  [C0402]
C375  100nF  [C0402]
C376  100nF  [C0402]
C377  100nF  [C0402]
C378  100nF  [C0402]
C379  100nF  [C0402]
C380  100nF  [C0402]
CO301  USB4070  [USB4070-30-C]
CO302  USB4070  [USB4070-30-C]
CO303  USB4070  [USB4070-30-C]
CO304  USB4070  [USB4070-30-C]
D351  TVS  [SOT-3]
D352  TVS  [SOT-3]
D353  TVS  [SOT-1176-1]
D354  TVS  [SOT-1176-1]
D355  TVS  [SOT-3]
D356  TVS  [SOT-3]
D357  TVS  [SOT-1176-1]
D358  TVS  [SOT-1176-1]
IC351  TUSB542  [X2QFN-18G_2.4X2]
IC352  TUSB542  [X2QFN-18G_2.4X2]
IC353  TUSB542  [X2QFN-18G_2.4X2]
IC354  TUSB542  [X2QFN-18G_2.4X2]

### Ports
+1V8, GND, USBF0 (harness HF0), USBF1 (harness HF1), USBF2 (harness HF2), USBF3 (harness HF3), VPWR

### Harnesses
HF0: USBF0_5V, USBF0_TX_P, USBF0_TX_N, USBF0_N, USBF0_RX_P, USBF0_RX_N, USBF0_SEL, USBF0_P, USBF0_CC, USBF0_SBU
HF1: USBF1_5V, USBF1_TX_P, USBF1_TX_N, USBF1_N, USBF1_RX_P, USBF1_RX_N, USBF1_SEL, USBF1_P, USBF1_CC, USBF1_SBU
HF2: USBF2_5V, USBF2_TX_P, USBF2_TX_N, USBF2_N, USBF2_RX_P, USBF2_RX_N, USBF2_SEL, USBF2_P, USBF2_CC, USBF2_SBU
HF3: USBF3_5V, USBF3_TX_P, USBF3_TX_N, USBF3_N, USBF3_RX_P, USBF3_RX_N, USBF3_SEL, USBF3_P, USBF3_CC, USBF3_SBU

### Nets
+1V8: C318.1 C320.1 C379.1 C380.1 IC351.5(VDD18) IC352.5(VDD18) IC353.5(VDD18) IC354.5(VDD18) ; port +1V8
GND: C318.2 C320.2 C379.2 C380.2 CO301.1(A1) CO301.12(A12) CO301.21(B1) CO301.32(B12) CO301.SH CO302.1(A1) CO302.12(A12) CO302.21(B1) CO302.32(B12) CO302.SH CO303.1(A1) CO303.12(A12) CO303.21(B1) CO303.32(B12) CO303.SH CO304.1(A1) CO304.12(A12) CO304.21(B1) CO304.32(B12) CO304.SH D351.3(GND) D352.3(GND) D353.3(GND) D353.8(GND) D354.3(GND) D354.8(GND) D355.3(GND) D356.3(GND) D357.3(GND) D357.8(GND) D358.3(GND) D358.8(GND) IC351.19(GND) IC352.19(GND) IC353.19(GND) IC354.19(GND) ; port GND  [also labelled SHD]
USBF0_5V: CO301.4(A4) CO301.9(A9) CO301.24(B4) CO301.29(B9) ; port USBF0.USBF0_5V
USBF0_CC1: CO301.5(A5) ; port USBF0.USBF0_CC
USBF0_CC2: CO301.25(B5) ; port USBF0.USBF0_SBU
USBF0_N: CO301.7(A7) CO301.27(B7) D351.1(D+) ; port USBF0.USBF0_N
USBF0_P: CO301.6(A6) CO301.26(B6) D351.2(D-) ; port USBF0.USBF0_P
USBF0_RX1_N: CO301.30(B10) IC351.2(RX_CON_1+)
USBF0_RX1_P: CO301.31(B11) IC351.3(RX_CON_1-)
USBF0_RX2_N: CO301.10(A10) IC351.8(RX_CON_2-)
USBF0_RX2_P: CO301.11(A11) IC351.9(RX_CON_2+)
USBF0_RX_N: C309.1 ; port USBF0.USBF0_RX_N
USBF0_RX_P: C313.1 ; port USBF0.USBF0_RX_P
USBF0_SEL: IC351.16(SEL) ; port USBF0.USBF0_SEL
USBF0_TX1_N: C307.2 CO301.3(A3)
USBF0_TX1_P: C303.2 CO301.2(A2)
USBF0_TX2_N: C311.2 CO301.23(B3)
USBF0_TX2_P: C315.2 CO301.22(B2)
USBF0_TX_N: C301.1 ; port USBF0.USBF0_TX_N
USBF0_TX_P: C305.1 ; port USBF0.USBF0_TX_P
USBF0_XRX_N: C309.2 D353.2(CH2) D353.9(NC) IC351.17(RX_AP-)
USBF0_XRX_P: C313.2 D353.1(CH1) D353.10(NC) IC351.18(RX_AP+)
USBF0_XTX1_N: C307.1 IC351.7(TX_CON_1-)
USBF0_XTX1_P: C303.1 IC351.6(TX_CON_1+)
USBF0_XTX2_N: C311.1 IC351.12(TX_CON_2+)
USBF0_XTX2_P: C315.1 IC351.11(TX_CON_2-)
USBF0_XTX_N: C301.2 D353.5(CH4) D353.6(NC) IC351.14(TX_AP-)
USBF0_XTX_P: C305.2 D353.4(CH3) D353.7(NC) IC351.15(TX_AP+)
USBF1_5V: CO302.4(A4) CO302.9(A9) CO302.24(B4) CO302.29(B9) ; port USBF1.USBF1_5V
USBF1_CC1: CO302.5(A5) ; port USBF1.USBF1_CC
USBF1_CC2: CO302.25(B5) ; port USBF1.USBF1_SBU
USBF1_N: CO302.7(A7) CO302.27(B7) D352.1(D+) ; port USBF1.USBF1_N
USBF1_P: CO302.6(A6) CO302.26(B6) D352.2(D-) ; port USBF1.USBF1_P
USBF1_RX1_N: CO302.30(B10) IC352.2(RX_CON_1+)
USBF1_RX1_P: CO302.31(B11) IC352.3(RX_CON_1-)
USBF1_RX2_N: CO302.10(A10) IC352.8(RX_CON_2-)
USBF1_RX2_P: CO302.11(A11) IC352.9(RX_CON_2+)
USBF1_RX_N: C310.1 ; port USBF1.USBF1_RX_N
USBF1_RX_P: C314.1 ; port USBF1.USBF1_RX_P
USBF1_SEL: IC352.16(SEL) ; port USBF1.USBF1_SEL
USBF1_TX1_N: C308.2 CO302.3(A3)
USBF1_TX1_P: C304.2 CO302.2(A2)
USBF1_TX2_N: C312.2 CO302.23(B3)
USBF1_TX2_P: C316.2 CO302.22(B2)
USBF1_TX_N: C302.1 ; port USBF1.USBF1_TX_N
USBF1_TX_P: C306.1 ; port USBF1.USBF1_TX_P
USBF1_XRX_N: C310.2 D354.2(CH2) D354.9(NC) IC352.17(RX_AP-)
USBF1_XRX_P: C314.2 D354.1(CH1) D354.10(NC) IC352.18(RX_AP+)
USBF1_XTX1_N: C308.1 IC352.7(TX_CON_1-)
USBF1_XTX1_P: C304.1 IC352.6(TX_CON_1+)
USBF1_XTX2_N: C312.1 IC352.12(TX_CON_2+)
USBF1_XTX2_P: C316.1 IC352.11(TX_CON_2-)
USBF1_XTX_N: C302.2 D354.5(CH4) D354.6(NC) IC352.14(TX_AP-)
USBF1_XTX_P: C306.2 D354.4(CH3) D354.7(NC) IC352.15(TX_AP+)
USBF2_5V: CO303.4(A4) CO303.9(A9) CO303.24(B4) CO303.29(B9) ; port USBF2.USBF2_5V
USBF2_CC1: CO303.5(A5) ; port USBF2.USBF2_CC
USBF2_CC2: CO303.25(B5) ; port USBF2.USBF2_SBU
USBF2_N: CO303.7(A7) CO303.27(B7) D355.1(D+) ; port USBF2.USBF2_N
USBF2_P: CO303.6(A6) CO303.26(B6) D355.2(D-) ; port USBF2.USBF2_P
USBF2_RX1_N: CO303.30(B10) IC353.2(RX_CON_1+)
USBF2_RX1_P: CO303.31(B11) IC353.3(RX_CON_1-)
USBF2_RX2_N: CO303.10(A10) IC353.8(RX_CON_2-)
USBF2_RX2_P: CO303.11(A11) IC353.9(RX_CON_2+)
USBF2_RX_N: C371.1 ; port USBF2.USBF2_RX_N
USBF2_RX_P: C375.1 ; port USBF2.USBF2_RX_P
USBF2_SEL: IC353.16(SEL) ; port USBF2.USBF2_SEL
USBF2_TX1_N: C369.2 CO303.3(A3)
USBF2_TX1_P: C323.2 CO303.2(A2)
USBF2_TX2_N: C373.2 CO303.23(B3)
USBF2_TX2_P: C377.2 CO303.22(B2)
USBF2_TX_N: C321.1 ; port USBF2.USBF2_TX_N
USBF2_TX_P: C367.1 ; port USBF2.USBF2_TX_P
USBF2_XRX_N: C371.2 D357.2(CH2) D357.9(NC) IC353.17(RX_AP-)
USBF2_XRX_P: C375.2 D357.1(CH1) D357.10(NC) IC353.18(RX_AP+)
USBF2_XTX1_N: C369.1 IC353.7(TX_CON_1-)
USBF2_XTX1_P: C323.1 IC353.6(TX_CON_1+)
USBF2_XTX2_N: C373.1 IC353.12(TX_CON_2+)
USBF2_XTX2_P: C377.1 IC353.11(TX_CON_2-)
USBF2_XTX_N: C321.2 D357.5(CH4) D357.6(NC) IC353.14(TX_AP-)
USBF2_XTX_P: C367.2 D357.4(CH3) D357.7(NC) IC353.15(TX_AP+)
USBF3_5V: CO304.4(A4) CO304.9(A9) CO304.24(B4) CO304.29(B9) ; port USBF3.USBF3_5V
USBF3_CC1: CO304.5(A5) ; port USBF3.USBF3_CC
USBF3_CC2: CO304.25(B5) ; port USBF3.USBF3_SBU
USBF3_N: CO304.7(A7) CO304.27(B7) D356.1(D+) ; port USBF3.USBF3_N
USBF3_P: CO304.6(A6) CO304.26(B6) D356.2(D-) ; port USBF3.USBF3_P
USBF3_RX1_N: CO304.30(B10) IC354.2(RX_CON_1+)
USBF3_RX1_P: CO304.31(B11) IC354.3(RX_CON_1-)
USBF3_RX2_N: CO304.10(A10) IC354.8(RX_CON_2-)
USBF3_RX2_P: CO304.11(A11) IC354.9(RX_CON_2+)
USBF3_RX_N: C372.1 ; port USBF3.USBF3_RX_N
USBF3_RX_P: C376.1 ; port USBF3.USBF3_RX_P
USBF3_SEL: IC354.16(SEL) ; port USBF3.USBF3_SEL
USBF3_TX1_N: C370.2 CO304.3(A3)
USBF3_TX1_P: C324.2 CO304.2(A2)
USBF3_TX2_N: C374.2 CO304.23(B3)
USBF3_TX2_P: C378.2 CO304.22(B2)
USBF3_TX_N: C322.1 ; port USBF3.USBF3_TX_N
USBF3_TX_P: C368.1 ; port USBF3.USBF3_TX_P
USBF3_XRX_N: C372.2 D358.2(CH2) D358.9(NC) IC354.17(RX_AP-)
USBF3_XRX_P: C376.2 D358.1(CH1) D358.10(NC) IC354.18(RX_AP+)
USBF3_XTX1_N: C370.1 IC354.7(TX_CON_1-)
USBF3_XTX1_P: C324.1 IC354.6(TX_CON_1+)
USBF3_XTX2_N: C374.1 IC354.12(TX_CON_2+)
USBF3_XTX2_P: C378.1 IC354.11(TX_CON_2-)
USBF3_XTX_N: C322.2 D358.5(CH4) D358.6(NC) IC354.14(TX_AP-)
USBF3_XTX_P: C368.2 D358.4(CH3) D358.7(NC) IC354.15(TX_AP+)

Not connected (* = marked no-connect by the designer): CO301 8(A8) 28(B8); CO302 8(A8) 28(B8); CO303 8(A8) 28(B8); CO304 8(A8) 28(B8); IC351 1(CNFG_A1) 4(CNFG_B1) 10(CNFG_B2) 13(CNFG_A2); IC352 1(CNFG_A1) 4(CNFG_B1) 10(CNFG_B2) 13(CNFG_A2); IC353 1(CNFG_A1) 4(CNFG_B1) 10(CNFG_B2) 13(CNFG_A2); IC354 1(CNFG_A1) 4(CNFG_B1) 10(CNFG_B2) 13(CNFG_A2)

### Layout directives
differential pair; differential pair class USB3: USBF0_N, USBF0_P, USBF0_RX1_N, USBF0_RX1_P, USBF0_RX2_N, USBF0_RX2_P, USBF0_RX_N, USBF0_RX_P, USBF0_TX1_N, USBF0_TX1_P, USBF0_TX2_N, USBF0_TX2_P, USBF0_TX_N, USBF0_TX_P, USBF0_XRX_N, USBF0_XRX_P, USBF0_XTX1_N, USBF0_XTX1_P, USBF0_XTX2_N, USBF0_XTX2_P, USBF0_XTX_N, USBF0_XTX_P, USBF1_N, USBF1_P, USBF1_RX1_N, USBF1_RX1_P, USBF1_RX2_N, USBF1_RX2_P, USBF1_RX_N, USBF1_RX_P, USBF1_TX1_N, USBF1_TX1_P, USBF1_TX2_N, USBF1_TX2_P, USBF1_TX_N, USBF1_TX_P, USBF1_XRX_N, USBF1_XRX_P, USBF1_XTX1_N, USBF1_XTX1_P, USBF1_XTX2_N, USBF1_XTX2_P, USBF1_XTX_N, USBF1_XTX_P, USBF2_N, USBF2_P, USBF2_RX1_N, USBF2_RX1_P, USBF2_RX2_N, USBF2_RX2_P, USBF2_RX_N, USBF2_RX_P, USBF2_TX1_N, USBF2_TX1_P, USBF2_TX2_N, USBF2_TX2_P, USBF2_TX_N, USBF2_TX_P, USBF2_XRX_N, USBF2_XRX_P, USBF2_XTX1_N, USBF2_XTX1_P, USBF2_XTX2_N, USBF2_XTX2_P, USBF2_XTX_N, USBF2_XTX_P, USBF3_N, USBF3_P, USBF3_RX1_N, USBF3_RX1_P, USBF3_RX2_N, USBF3_RX2_P, USBF3_RX_N, USBF3_RX_P, USBF3_TX1_N, USBF3_TX1_P, USBF3_TX2_N, USBF3_TX2_P, USBF3_TX_N, USBF3_TX_P, USBF3_XRX_N, USBF3_XRX_P, USBF3_XTX1_N, USBF3_XTX1_P, USBF3_XTX2_N, USBF3_XTX2_P, USBF3_XTX_N, USBF3_XTX_P

### Notes on the sheet
- Title
- Size:
- Date:
- File:
- A2
- Number:
- Time:
- Revision:
- Sheet
- of

### Library data of the parts
C301-C316 C318 C320-C324 C367-C380 = CA0010: 100nF 16V 10% X7R; Part Number: CA0010; ManfactPart: GCM155R71C104KA55D; ID: 10; RefVal: 100nF
CO301-CO304 = CO0021: USB C connector Receptacle Vertical; Part Number: CO0021; ID: 16; RefVal: USB4070; ManfactPart: USB4070-30-C
D351 D352 D355 D356 = DI0002: USB 2 TVS Diode; Part Number: DI0002; ManfactPart: TPD2EUSB30DRTR; ID: 2; RefVal: TVS
D353 D354 D357 D358 = DI0007: USB 3 TVS Diode; Part Number: DI0007; ManfactPart: PUSB3FA2Z; ID: 7; RefVal: TVS
IC351-IC354 = IC0039: TUSB542 USB Type-C 5 Gbps Redriver 2:1 MUX; Part Number: IC0039; ID: 39; RefVal: TUSB542; ManfactPart: TUSB542

## Sheet 501_RPi0.SchDoc: RPi Zero Wireless
size A2; Organization: Greenfield Tech Solutions; Address1: Molendreef 33; Address2: Ossendrecht; Address3: 4641CS; Address4: The Netherlands; DocumentNumber: P234; Revision: 0.6; SheetNumber: 6; SheetTotal: 9
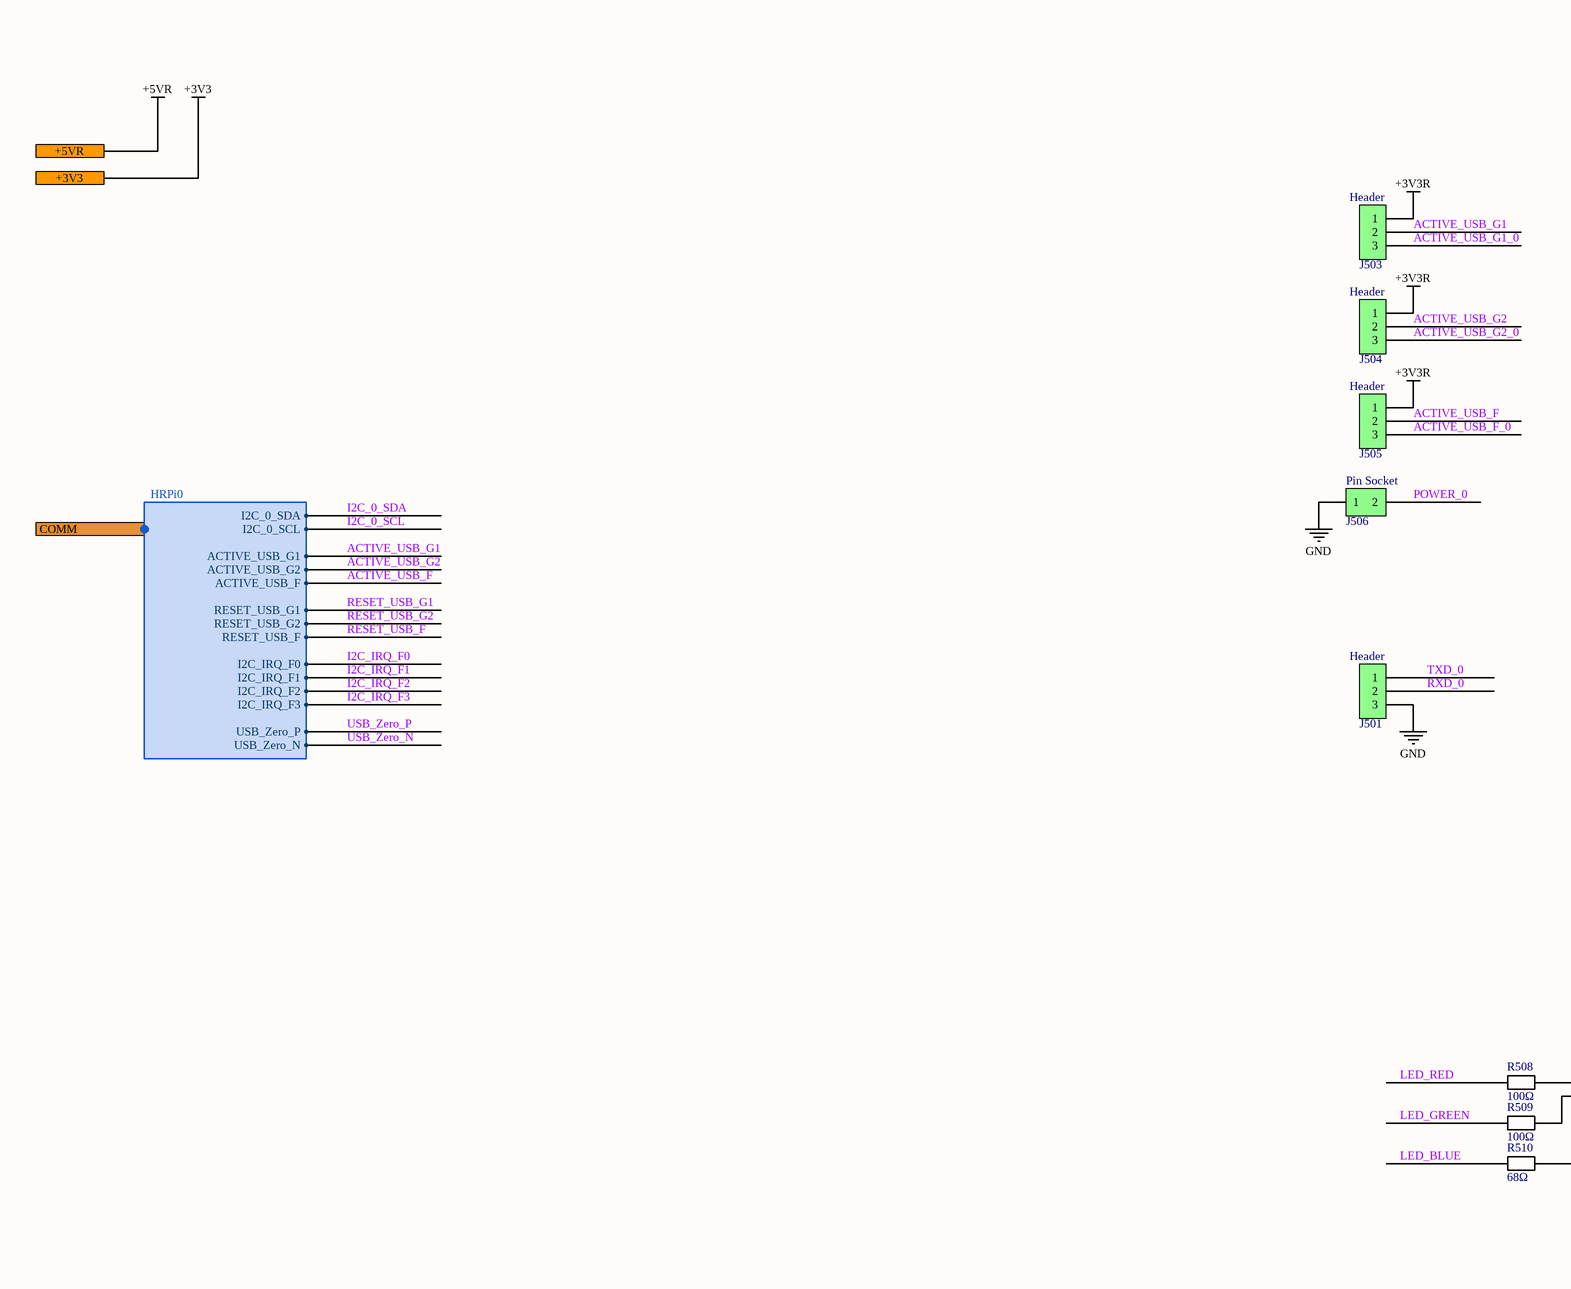
[diagram p8: 501_RPi0.SchDoc, left]
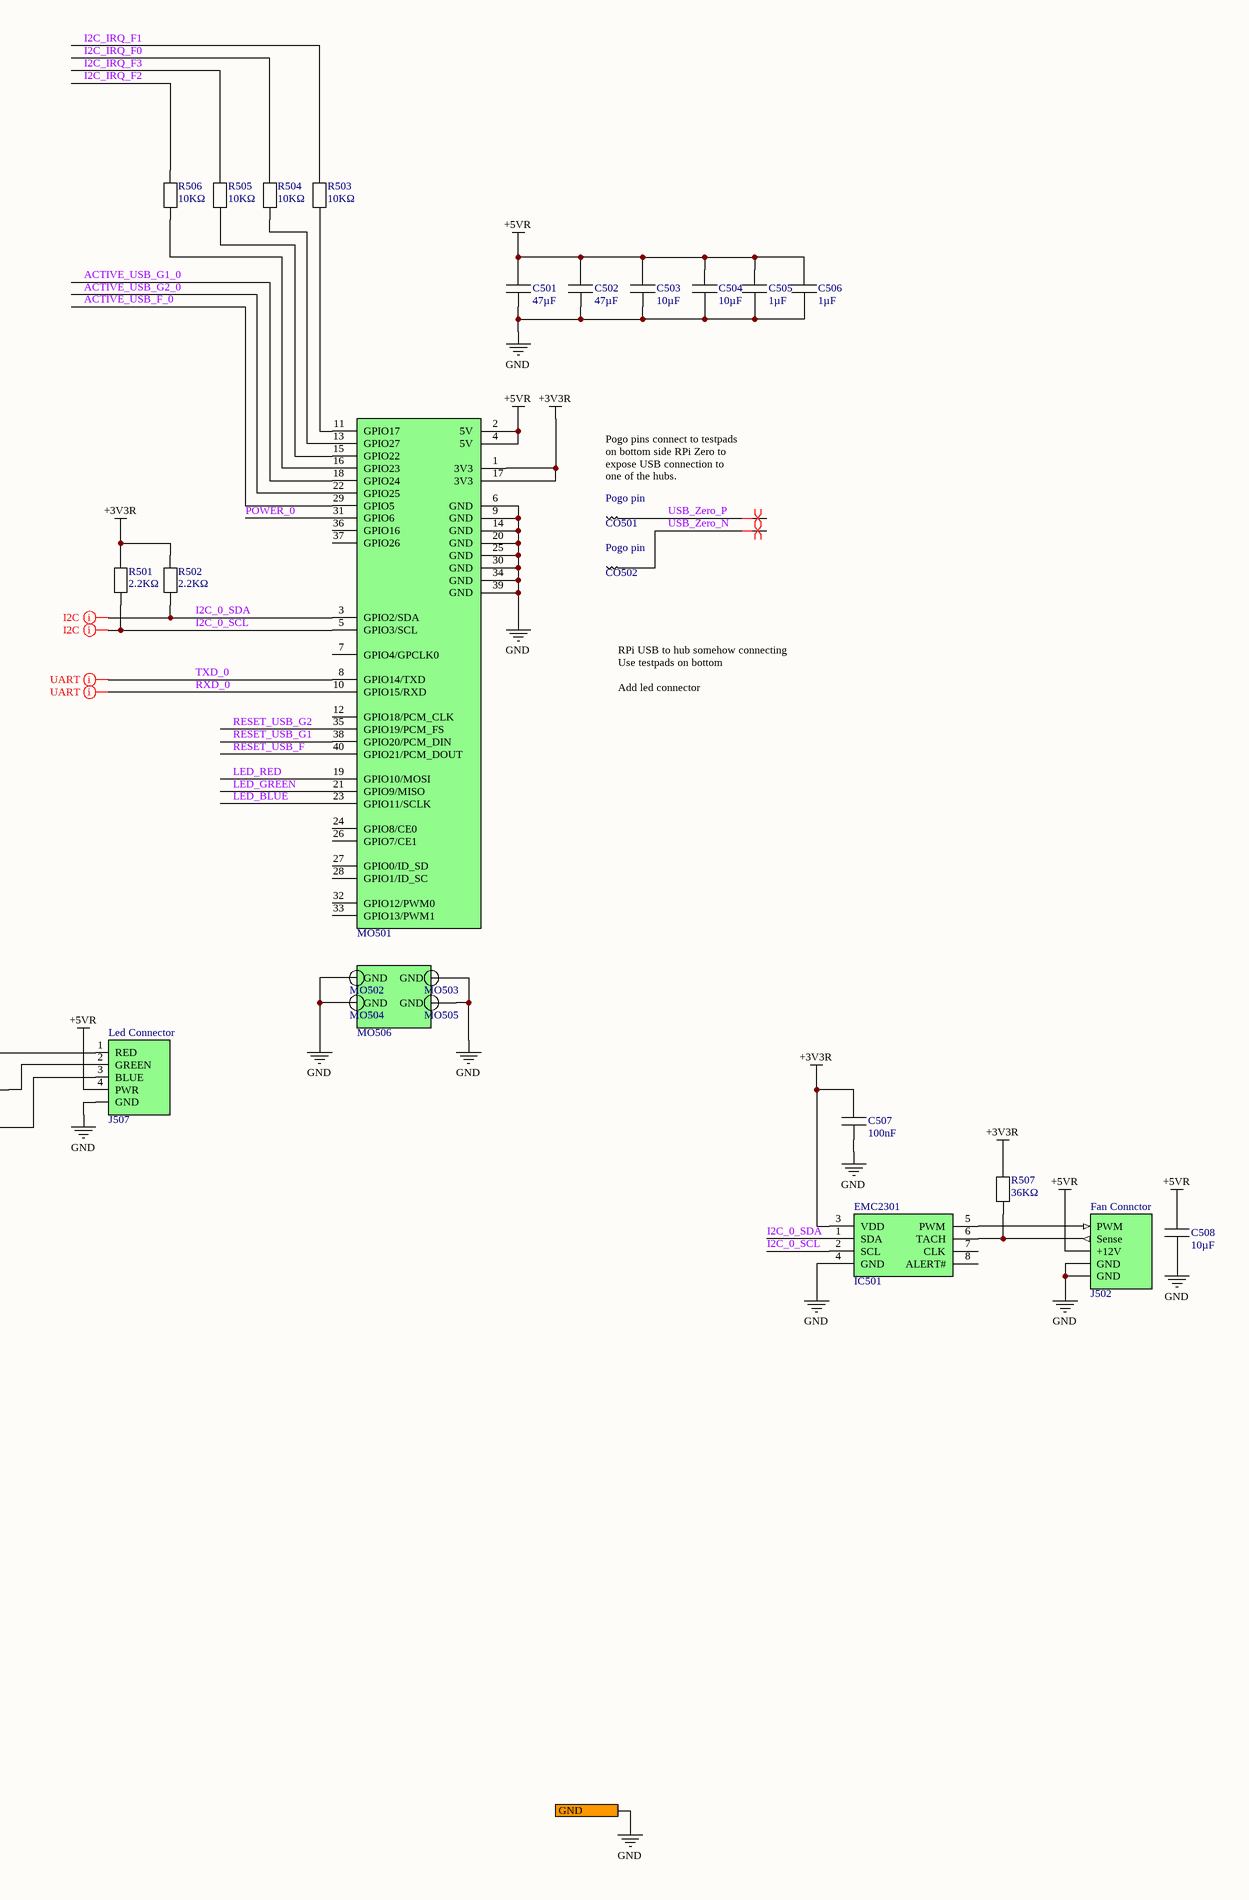
[diagram p9: 501_RPi0.SchDoc, right]

### Parts
C501  47µF  [C1210]
C502  47µF  [C1210]
C503  10µF  [C0805]
C504  10µF  [C0805]
C505  1µF  [C0603]
C506  1µF  [C0603]
C507  100nF  [C0402]
C508  10µF  [C0805]
CO501  Pogo pin  [POGO-0906]
CO502  Pogo pin  [POGO-0906]
IC501  EMC2301  [MSOP-8_3X3]
J501  Header  [1X3P_2.54mm]
J502  Fan Connctor  [SM04B]
J503  Header  [1X3P_2.54mm]
J504  Header  [1X3P_2.54mm]
J505  Header  [1X3P_2.54mm]
J506  Pin Socket  [1X2P_Socket_2.54mm]
J507  Led Connector  [SM04B]
MO501  ZeroW-1  [RPIZeroW_Pins]  (value not drawn)
MO502  ZeroW-M  [CM4-M]  (value not drawn)
MO503  ZeroW-M  [CM4-M]  (value not drawn)
MO504  ZeroW-M  [CM4-M]  (value not drawn)
MO505  ZeroW-M  [CM4-M]  (value not drawn)
MO506  ZeroW  [RPIZeroW_Layout]  (value not drawn)
R501  2.2KΩ  [R0402]
R502  2.2KΩ  [R0402]
R503  10KΩ  [R0402]
R504  10KΩ  [R0402]
R505  10KΩ  [R0402]
R506  10KΩ  [R0402]
R507  36KΩ  [R0402]
R508  100Ω  [R0402]
R509  100Ω  [R0402]
R510  68Ω  [R0402]

### Ports
+3V3, +5VR, COMM (harness HRPi0), GND

### Harnesses
HRPi0: I2C_0_SCL, I2C_0_SDA, I2C_IRQ_F0, I2C_IRQ_F1, I2C_IRQ_F3, I2C_IRQ_F2, ACTIVE_USB_G1, ACTIVE_USB_F, ACTIVE_USB_G2, RESET_USB_G1, RESET_USB_F, RESET_USB_G2, USB_Zero_N, USB_Zero_P

### Nets
+3V3R: C507.1 IC501.3(VDD) J503.1 J504.1 J505.1 MO501.1(3V3) MO501.17(3V3) R501.2 R502.2 R507.2
+5VR: C501.1 C502.1 C503.1 C504.1 C505.1 C506.1 C508.1 J502.3(+12V) J507.4(PWR) MO501.2(5V) MO501.4(5V) ; port +5VR
GND: C501.2 C502.2 C503.2 C504.2 C505.2 C506.2 C507.2 C508.2 IC501.4(GND) J501.3 J502.4(GND) J502.5(GND) J506.1 J507.5(GND) MO501.6(GND) MO501.9(GND) MO501.14(GND) MO501.20(GND) MO501.25(GND) MO501.30(GND) MO501.34(GND) MO501.39(GND) MO502.GND MO503.GND MO504.GND MO505.GND ; port GND
ACTIVE_USB_F: J505.2 ; port COMM.ACTIVE_USB_F
ACTIVE_USB_F_0: J505.3 MO501.29(GPIO5)
ACTIVE_USB_G1: J503.2 ; port COMM.ACTIVE_USB_G1
ACTIVE_USB_G1_0: J503.3 MO501.18(GPIO24)
ACTIVE_USB_G2: J504.2 ; port COMM.ACTIVE_USB_G2
ACTIVE_USB_G2_0: J504.3 MO501.22(GPIO25)
I2C_0_SCL: IC501.2(SCL) MO501.5(GPIO3/SCL) R501.1 ; port COMM.I2C_0_SCL
I2C_0_SDA: IC501.1(SDA) MO501.3(GPIO2/SDA) R502.1 ; port COMM.I2C_0_SDA
I2C_IRQ_F0: R504.2 ; port COMM.I2C_IRQ_F0
I2C_IRQ_F1: R503.2 ; port COMM.I2C_IRQ_F1
I2C_IRQ_F2: R506.2 ; port COMM.I2C_IRQ_F2
I2C_IRQ_F3: R505.2 ; port COMM.I2C_IRQ_F3
LED_BLUE: MO501.23(GPIO11/SCLK) R510.1
LED_GREEN: MO501.21(GPIO9/MISO) R509.1
LED_RED: MO501.19(GPIO10/MOSI) R508.1
POWER_0: J506.2 MO501.31(GPIO6)
RESET_USB_F: MO501.40(GPIO21/PCM_DOUT) ; port COMM.RESET_USB_F
RESET_USB_G1: MO501.38(GPIO20/PCM_DIN) ; port COMM.RESET_USB_G1
RESET_USB_G2: MO501.35(GPIO19/PCM_FS) ; port COMM.RESET_USB_G2
RXD_0: J501.2 MO501.10(GPIO15/RXD)
TXD_0: J501.1 MO501.8(GPIO14/TXD)
USB_Zero_N: CO502.1 ; port COMM.USB_Zero_N
USB_Zero_P: CO501.1 ; port COMM.USB_Zero_P
NetIC501_5: IC501.5(PWM) J502.1(PWM)
NetIC501_6: IC501.6(TACH) J502.2(Sense) R507.1
NetJ507_1: J507.1(RED) R508.2
NetJ507_2: J507.2(GREEN) R509.2
NetJ507_3: J507.3(BLUE) R510.2
NetMO501_11: MO501.11(GPIO17) R503.1
NetMO501_13: MO501.13(GPIO27) R504.1
NetMO501_15: MO501.15(GPIO22) R505.1
NetMO501_16: MO501.16(GPIO23) R506.1

Not connected (* = marked no-connect by the designer): IC501 7(CLK) 8(ALERT#); MO501 7(GPIO4/GPCLK0) 12(GPIO18/PCM_CLK) 24(GPIO8/CE0) 26(GPIO7/CE1) 27(GPIO0/ID_SD) 28(GPIO1/ID_SC) 32(GPIO12/PWM0) 33(GPIO13/PWM1) 36(GPIO16) 37(GPIO26)

### Layout directives
net class I2C_0: I2C_0_SCL, I2C_0_SDA
net class UART_0: RXD_0, TXD_0
differential pair; differential pair class USB3: USB_Zero_N, USB_Zero_P

### Notes on the sheet
- (near CO501) Pogo pins connect to testpads on bottom side RPi Zero to expose USB connection to one of the hubs.
- RPi USB to hub somehow connecting
  Use testpads on bottom
  Add led connector
- Title
- Size:
- Date:
- File:
- A2
- Number:
- Time:
- Revision:
- Sheet
- of

### Library data of the parts
C501 C502 = CA0007: 47µF 16V 20% X5R; Part Number: CA0007; ManfactPart: EMK325ABJ476MM8P; ID: 7; RefVal: 47µF
C503 C504 C508 = CA0001: as C111 on sheet 101_Power; RefVal: 10µF
C505 C506 = CA0003: 1µF 16V 10% X5R; Part Number: CA0003; ManfactPart: C1608X5R1C105K080AA; ID: 3; RefVal: 1µF
C507 = CA0010: as C301 on sheet 301_FrameUSB; RefVal: 100nF
CO501 CO502 = CO0058: Pogo pin 3mm TH; Part Number: CO0058; ManfactPart: 0906-0-15-20-76-14-11-0; ID: 58; RefVal: Pogo pin
IC501 = IC0054: Board Mount Temperature Sensors Single RPB-Based PWM Fan Speed CNTRL; Part Number: IC0054; ManfactPart: EMC2301-1-ACZL-TR; ID: 54; RefVal: EMC2301
J501 J503-J505 = CO0018: Header 1x3P; Part Number: CO0018; ManfactPart: G800W305018EU; ID: 32; RefVal: Header
J502 = CO0055: Connector Header SMD R/A 4POS 1MM; Part Number: CO0055; ManfactPart: SM04B-SRSS-TB; ID: 55; RefVal: Fan Connctor
J506 = CO0060: Socket Strip with Square Tails; Part Number: CO0060; ManfactPart: SSQ-102-02-S-S; ID: 60; RefVal: Pin Socket
J507 = CO0056: Connector Header SMD R/A 4POS 1MM for LED4PG-15-23B/R6G6BHC-A01/2T; Part Number: CO0056; ManfactPart: SM04B-SRSS-TB; ID: 56; RefVal: Led Connector
MO501 = MO0018: RPI ZeroW Pin 1-40; Part Number: MO0018; ManfactPart: 61304021121; ID: 18; RefVal: ZeroW-1
MO502-MO505 = MO0016: RPI ZeroW Mounting Studs; Part Number: MO0016; ManfactPart: 9774030151R; ID: 16; RefVal: ZeroW-M
MO506 = MO0015: Outline of ZeroW; Part Number: MO0015; ManfactPart: RPI Zero W; ID: 15; RefVal: ZeroW
R501 R502 = RS0020: 2.2KΩ 5% 62.5mW; Part Number: RS0020; ManfactPart: MCMR04X222 JTL; ID: 20; RefVal: 2.2KΩ
R503-R506 = RS0011: as R107 on sheet 101_Power; RefVal: 10KΩ
R507 = RS0051: 36KΩ 1% 62.5mW 100PPM; Part Number: RS0051; ManfactPart: ERJ-2RKF3602X; ID: 51; RefVal: 36KΩ
R508 R509 = RS0082: 120Ω 1% 62.5mW 100PPM; Part Number: RS0082; ManfactPart: CRG0402F120R; ID: 82; RefVal: 100Ω
R510 = RS0081: 68Ω 1% 62.5mW 100PPM; Part Number: RS0081; ManfactPart: CR0402-FX-68R0GLF; ID: 81; RefVal: 68Ω

## Sheet 401_FramePWR.schdoc: Framework Modules Power
size A2; Organization: Greenfield Tech Solutions; Address1: Molendreef 33; Address2: Ossendrecht; Address3: 4641CS; Address4: The Netherlands; DocumentNumber: P234; Revision: 0.6; SheetNumber: 5; SheetTotal: 9
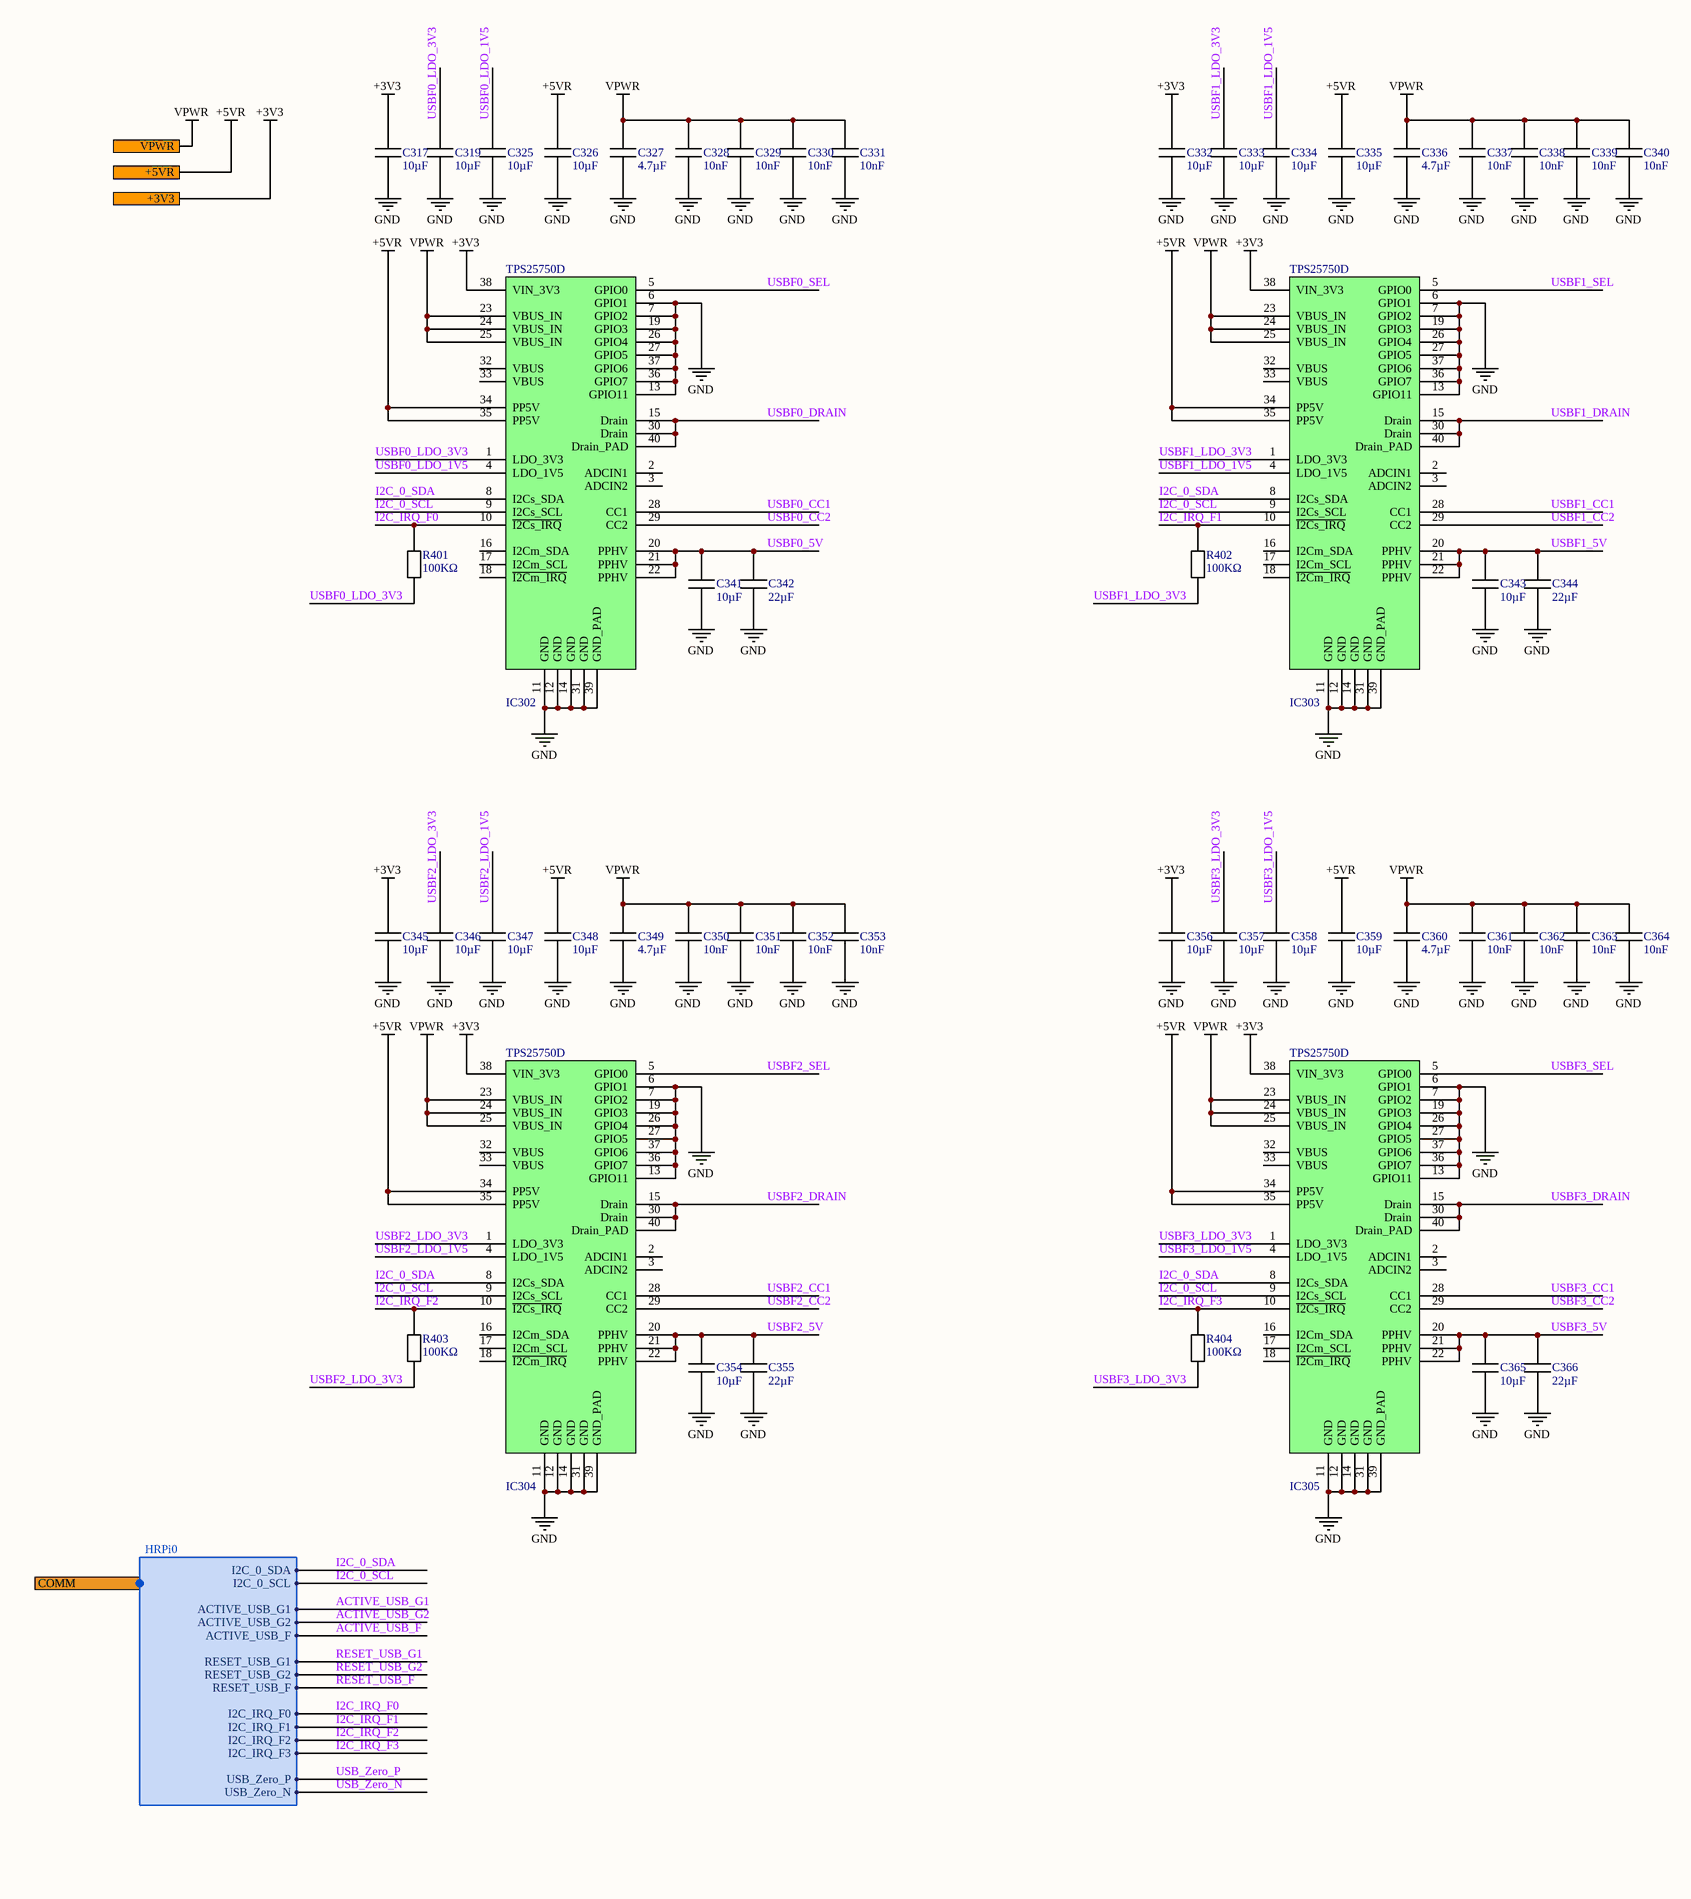
[diagram p10: 401_FramePWR.schdoc, left]
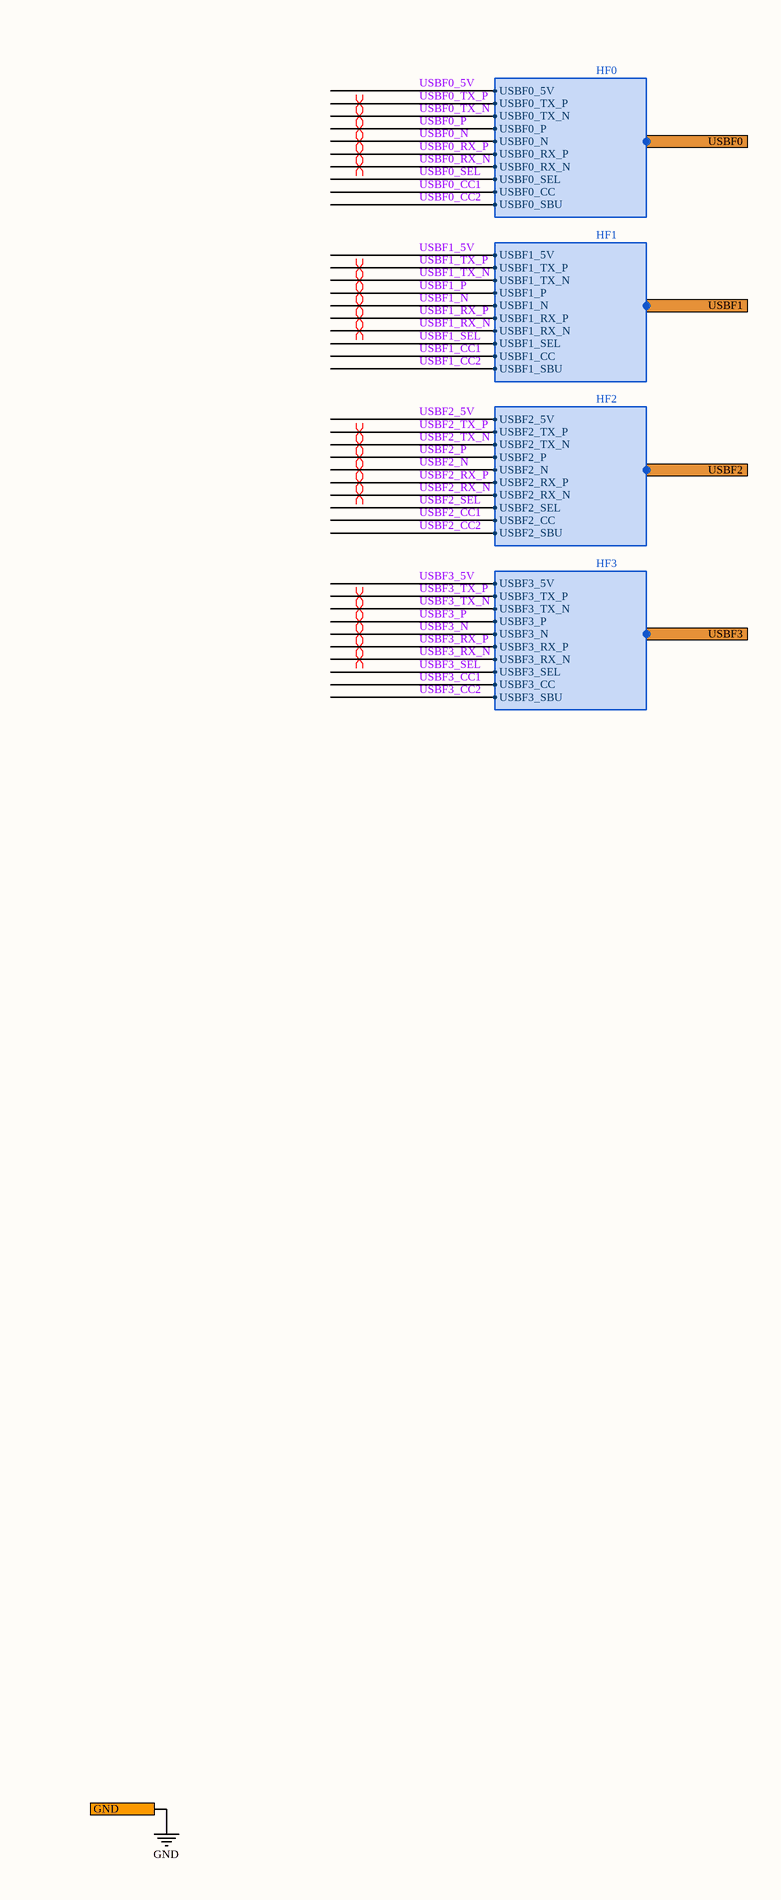
[diagram p11: 401_FramePWR.schdoc, right]

### Parts
C317  10µF  [C0805]
C319  10µF  [C0805]
C325  10µF  [C0805]
C326  10µF  [C0805]
C327  4.7µF  [C1210]
C328  10nF  [C0805]
C329  10nF  [C0805]
C330  10nF  [C0805]
C331  10nF  [C0805]
C332  10µF  [C0805]
C333  10µF  [C0805]
C334  10µF  [C0805]
C335  10µF  [C0805]
C336  4.7µF  [C1210]
C337  10nF  [C0805]
C338  10nF  [C0805]
C339  10nF  [C0805]
C340  10nF  [C0805]
C341  10µF  [C1210]
C342  22µF  [C2220]
C343  10µF  [C1210]
C344  22µF  [C2220]
C345  10µF  [C0805]
C346  10µF  [C0805]
C347  10µF  [C0805]
C348  10µF  [C0805]
C349  4.7µF  [C1210]
C350  10nF  [C0805]
C351  10nF  [C0805]
C352  10nF  [C0805]
C353  10nF  [C0805]
C354  10µF  [C1210]
C355  22µF  [C2220]
C356  10µF  [C0805]
C357  10µF  [C0805]
C358  10µF  [C0805]
C359  10µF  [C0805]
C360  4.7µF  [C1210]
C361  10nF  [C0805]
C362  10nF  [C0805]
C363  10nF  [C0805]
C364  10nF  [C0805]
C365  10µF  [C1210]
C366  22µF  [C2220]
IC302  TPS25750D  [QFNRJK-38]
IC303  TPS25750D  [QFNRJK-38]
IC304  TPS25750D  [QFNRJK-38]
IC305  TPS25750D  [QFNRJK-38]
R401  100KΩ  [R0402]
R402  100KΩ  [R0402]
R403  100KΩ  [R0402]
R404  100KΩ  [R0402]

### Ports
+3V3, +5VR, COMM (harness HRPi0), GND, USBF0 (harness HF0), USBF1 (harness HF1), USBF2 (harness HF2), USBF3 (harness HF3), VPWR

### Harnesses
HF0: USBF0_5V, USBF0_TX_P, USBF0_TX_N, USBF0_N, USBF0_RX_P, USBF0_RX_N, USBF0_SEL, USBF0_P, USBF0_CC, USBF0_SBU
HF1: USBF1_5V, USBF1_TX_P, USBF1_TX_N, USBF1_N, USBF1_RX_P, USBF1_RX_N, USBF1_SEL, USBF1_P, USBF1_CC, USBF1_SBU
HF2: USBF2_5V, USBF2_TX_P, USBF2_TX_N, USBF2_N, USBF2_RX_P, USBF2_RX_N, USBF2_SEL, USBF2_P, USBF2_CC, USBF2_SBU
HF3: USBF3_5V, USBF3_TX_P, USBF3_TX_N, USBF3_N, USBF3_RX_P, USBF3_RX_N, USBF3_SEL, USBF3_P, USBF3_CC, USBF3_SBU
HRPi0: I2C_0_SCL, I2C_0_SDA, I2C_IRQ_F0, I2C_IRQ_F1, I2C_IRQ_F3, I2C_IRQ_F2, ACTIVE_USB_G1, ACTIVE_USB_F, ACTIVE_USB_G2, RESET_USB_G1, RESET_USB_F, RESET_USB_G2, USB_Zero_N, USB_Zero_P

### Nets
+3V3: C317.1 C332.1 C345.1 C356.1 IC302.38(VIN_3V3) IC303.38(VIN_3V3) IC304.38(VIN_3V3) IC305.38(VIN_3V3) ; port +3V3
+5VR: C326.1 C335.1 C348.1 C359.1 IC302.34(PP5V) IC302.35(PP5V) IC303.34(PP5V) IC303.35(PP5V) IC304.34(PP5V) IC304.35(PP5V) IC305.34(PP5V) IC305.35(PP5V) ; port +5VR
GND: C317.2 C319.2 C325.2 C326.2 C327.2 C328.2 C329.2 C330.2 C331.2 C332.2 C333.2 C334.2 C335.2 C336.2 C337.2 C338.2 C339.2 C340.2 C341.2 C342.2 C343.2 C344.2 C345.2 C346.2 C347.2 C348.2 C349.2 C350.2 C351.2 C352.2 C353.2 C354.2 C355.2 C356.2 C357.2 C358.2 C359.2 C360.2 C361.2 C362.2 C363.2 C364.2 C365.2 C366.2 IC302.6(GPIO1) IC302.7(GPIO2) IC302.11(GND) IC302.12(GND) IC302.13(GPIO11) IC302.14(GND) IC302.19(GPIO3) IC302.26(GPIO4) IC302.27(GPIO5) IC302.31(GND) IC302.36(GPIO7) IC302.37(GPIO6) IC302.39(GND_PAD) IC303.6(GPIO1) IC303.7(GPIO2) IC303.11(GND) IC303.12(GND) IC303.13(GPIO11) IC303.14(GND) IC303.19(GPIO3) IC303.26(GPIO4) IC303.27(GPIO5) IC303.31(GND) IC303.36(GPIO7) IC303.37(GPIO6) IC303.39(GND_PAD) IC304.6(GPIO1) IC304.7(GPIO2) IC304.11(GND) IC304.12(GND) IC304.13(GPIO11) IC304.14(GND) IC304.19(GPIO3) IC304.26(GPIO4) IC304.27(GPIO5) IC304.31(GND) IC304.36(GPIO7) IC304.37(GPIO6) IC304.39(GND_PAD) IC305.6(GPIO1) IC305.7(GPIO2) IC305.11(GND) IC305.12(GND) IC305.13(GPIO11) IC305.14(GND) IC305.19(GPIO3) IC305.26(GPIO4) IC305.27(GPIO5) IC305.31(GND) IC305.36(GPIO7) IC305.37(GPIO6) IC305.39(GND_PAD) ; port GND
VPWR: C327.1 C328.1 C329.1 C330.1 C331.1 C336.1 C337.1 C338.1 C339.1 C340.1 C349.1 C350.1 C351.1 C352.1 C353.1 C360.1 C361.1 C362.1 C363.1 C364.1 IC302.23(VBUS_IN) IC302.24(VBUS_IN) IC302.25(VBUS_IN) IC303.23(VBUS_IN) IC303.24(VBUS_IN) IC303.25(VBUS_IN) IC304.23(VBUS_IN) IC304.24(VBUS_IN) IC304.25(VBUS_IN) IC305.23(VBUS_IN) IC305.24(VBUS_IN) IC305.25(VBUS_IN) ; port VPWR
I2C_0_SCL: IC302.9(I2Cs_SCL) IC303.9(I2Cs_SCL) IC304.9(I2Cs_SCL) IC305.9(I2Cs_SCL) ; port COMM.I2C_0_SCL
I2C_0_SDA: IC302.8(I2Cs_SDA) IC303.8(I2Cs_SDA) IC304.8(I2Cs_SDA) IC305.8(I2Cs_SDA) ; port COMM.I2C_0_SDA
I2C_IRQ_F0: IC302.10(~{I2Cs_IRQ}) R401.2 ; port COMM.I2C_IRQ_F0
I2C_IRQ_F1: IC303.10(~{I2Cs_IRQ}) R402.2 ; port COMM.I2C_IRQ_F1
I2C_IRQ_F2: IC304.10(~{I2Cs_IRQ}) R403.2 ; port COMM.I2C_IRQ_F2
I2C_IRQ_F3: IC305.10(~{I2Cs_IRQ}) R404.2 ; port COMM.I2C_IRQ_F3
USBF0_5V: C341.1 C342.1 IC302.20(PPHV) IC302.21(PPHV) IC302.22(PPHV) ; port USBF0.USBF0_5V
USBF0_CC1: IC302.28(CC1) ; port USBF0.USBF0_CC
USBF0_CC2: IC302.29(CC2) ; port USBF0.USBF0_SBU
USBF0_DRAIN: IC302.15(Drain) IC302.30(Drain) IC302.40(Drain_PAD)
USBF0_LDO_1V5: C325.1 IC302.4(LDO_1V5)
USBF0_LDO_3V3: C319.1 IC302.1(LDO_3V3) R401.1
USBF0_SEL: IC302.5(GPIO0) ; port USBF0.USBF0_SEL
USBF1_5V: C343.1 C344.1 IC303.20(PPHV) IC303.21(PPHV) IC303.22(PPHV) ; port USBF1.USBF1_5V
USBF1_CC1: IC303.28(CC1) ; port USBF1.USBF1_CC
USBF1_CC2: IC303.29(CC2) ; port USBF1.USBF1_SBU
USBF1_DRAIN: IC303.15(Drain) IC303.30(Drain) IC303.40(Drain_PAD)
USBF1_LDO_1V5: C334.1 IC303.4(LDO_1V5)
USBF1_LDO_3V3: C333.1 IC303.1(LDO_3V3) R402.1
USBF1_SEL: IC303.5(GPIO0) ; port USBF1.USBF1_SEL
USBF2_5V: C354.1 C355.1 IC304.20(PPHV) IC304.21(PPHV) IC304.22(PPHV) ; port USBF2.USBF2_5V
USBF2_CC1: IC304.28(CC1) ; port USBF2.USBF2_CC
USBF2_CC2: IC304.29(CC2) ; port USBF2.USBF2_SBU
USBF2_DRAIN: IC304.15(Drain) IC304.30(Drain) IC304.40(Drain_PAD)
USBF2_LDO_1V5: C347.1 IC304.4(LDO_1V5)
USBF2_LDO_3V3: C346.1 IC304.1(LDO_3V3) R403.1
USBF2_SEL: IC304.5(GPIO0) ; port USBF2.USBF2_SEL
USBF3_5V: C365.1 C366.1 IC305.20(PPHV) IC305.21(PPHV) IC305.22(PPHV) ; port USBF3.USBF3_5V
USBF3_CC1: IC305.28(CC1) ; port USBF3.USBF3_CC
USBF3_CC2: IC305.29(CC2) ; port USBF3.USBF3_SBU
USBF3_DRAIN: IC305.15(Drain) IC305.30(Drain) IC305.40(Drain_PAD)
USBF3_LDO_1V5: C358.1 IC305.4(LDO_1V5)
USBF3_LDO_3V3: C357.1 IC305.1(LDO_3V3) R404.1
USBF3_SEL: IC305.5(GPIO0) ; port USBF3.USBF3_SEL

Not connected (* = marked no-connect by the designer): IC302 2(ADCIN1) 3(ADCIN2) 16(I2Cm_SDA) 17(I2Cm_SCL) 18(~{I2Cm_IRQ}) 32(VBUS) 33(VBUS); IC303 2(ADCIN1) 3(ADCIN2) 16(I2Cm_SDA) 17(I2Cm_SCL) 18(~{I2Cm_IRQ}) 32(VBUS) 33(VBUS); IC304 2(ADCIN1) 3(ADCIN2) 16(I2Cm_SDA) 17(I2Cm_SCL) 18(~{I2Cm_IRQ}) 32(VBUS) 33(VBUS); IC305 2(ADCIN1) 3(ADCIN2) 16(I2Cm_SDA) 17(I2Cm_SCL) 18(~{I2Cm_IRQ}) 32(VBUS) 33(VBUS)

### Layout directives
differential pair; differential pair class USB3: USBF0_N, USBF0_P, USBF0_RX_N, USBF0_RX_P, USBF0_TX_N, USBF0_TX_P, USBF1_N, USBF1_P, USBF1_RX_N, USBF1_RX_P, USBF1_TX_N, USBF1_TX_P, USBF2_N, USBF2_P, USBF2_RX_N, USBF2_RX_P, USBF2_TX_N, USBF2_TX_P, USBF3_N, USBF3_P, USBF3_RX_N, USBF3_RX_P, USBF3_TX_N, USBF3_TX_P

### Notes on the sheet
- Title
- Size:
- Date:
- File:
- A2
- Number:
- Time:
- Revision:
- Sheet
- of

### Library data of the parts
C317 C319 C325 C326 C332-C335 C345-C348 C356-C359 = CA0001: as C111 on sheet 101_Power; RefVal: 10µF
C327 C336 C349 C360 = CA0038: as C103 on sheet 101_Power; RefVal: 4.7µF
C328-C331 C337-C340 C350-C353 C361-C364 = CA0021: as C107 on sheet 101_Power; RefVal: 10nF
C341 C343 C354 C365 = CA0039: 10µF 63V 10% X7R; Part Number: CA0039; ManfactPart: CL32B106KMVNNWE; ID: 39; RefVal: 10µF
C342 C344 C355 C366 = CA0051: 22µF 63V 20% X7R; Part Number: CA0051; ManfactPart: KRM55WR71J226MH01K; ID: 51; RefVal: 22µF
IC302-IC305 = IC0041: USB Type-C and USB PD Controller with Integrated Power Switches Optimized for Power Applications; Part Number: IC0041; ID: 41; RefVal: TPS25750D; ManfactPart: TPS25750D
R401-R404 = RS0036: as R102 on sheet 101_Power; RefVal: 100KΩ

## Sheet 201_ConnectionPart2-Part1.SchDoc: Connector to Part 1
size A2; Organization: Greenfield Tech Solutions; Address1: Molendreef 33; Address2: Ossendrecht; Address3: 4641CS; Address4: The Netherlands; DocumentNumber: P234; Revision: 0.6; SheetNumber: 3; SheetTotal: 9
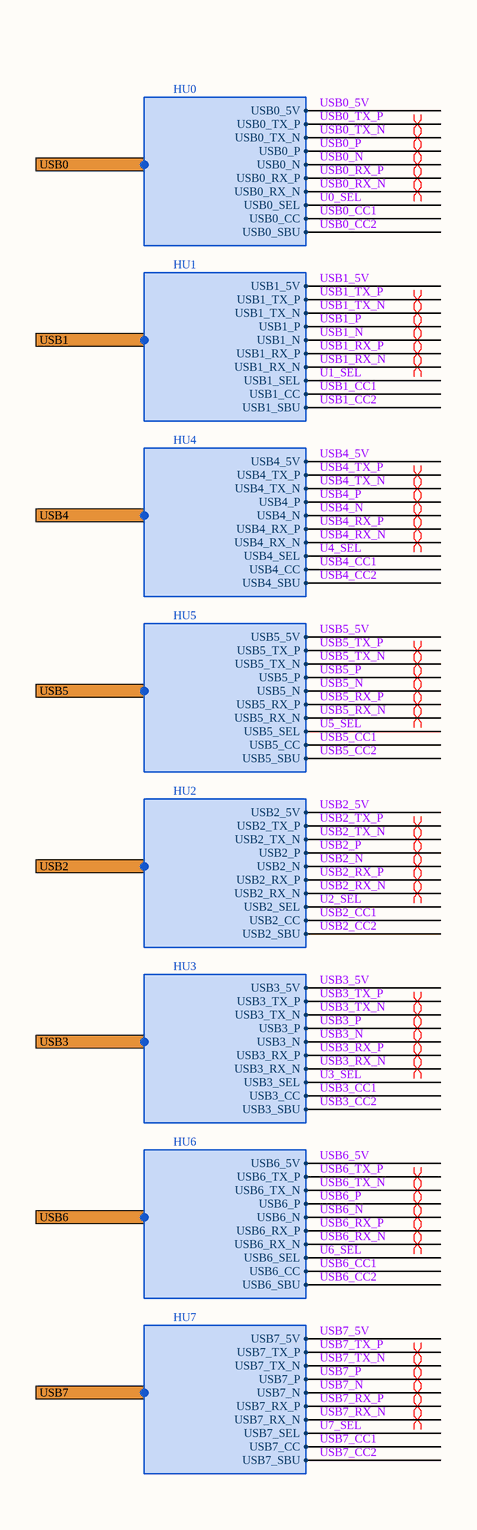
[diagram p12: 201_ConnectionPart2-Part1.SchDoc, left]
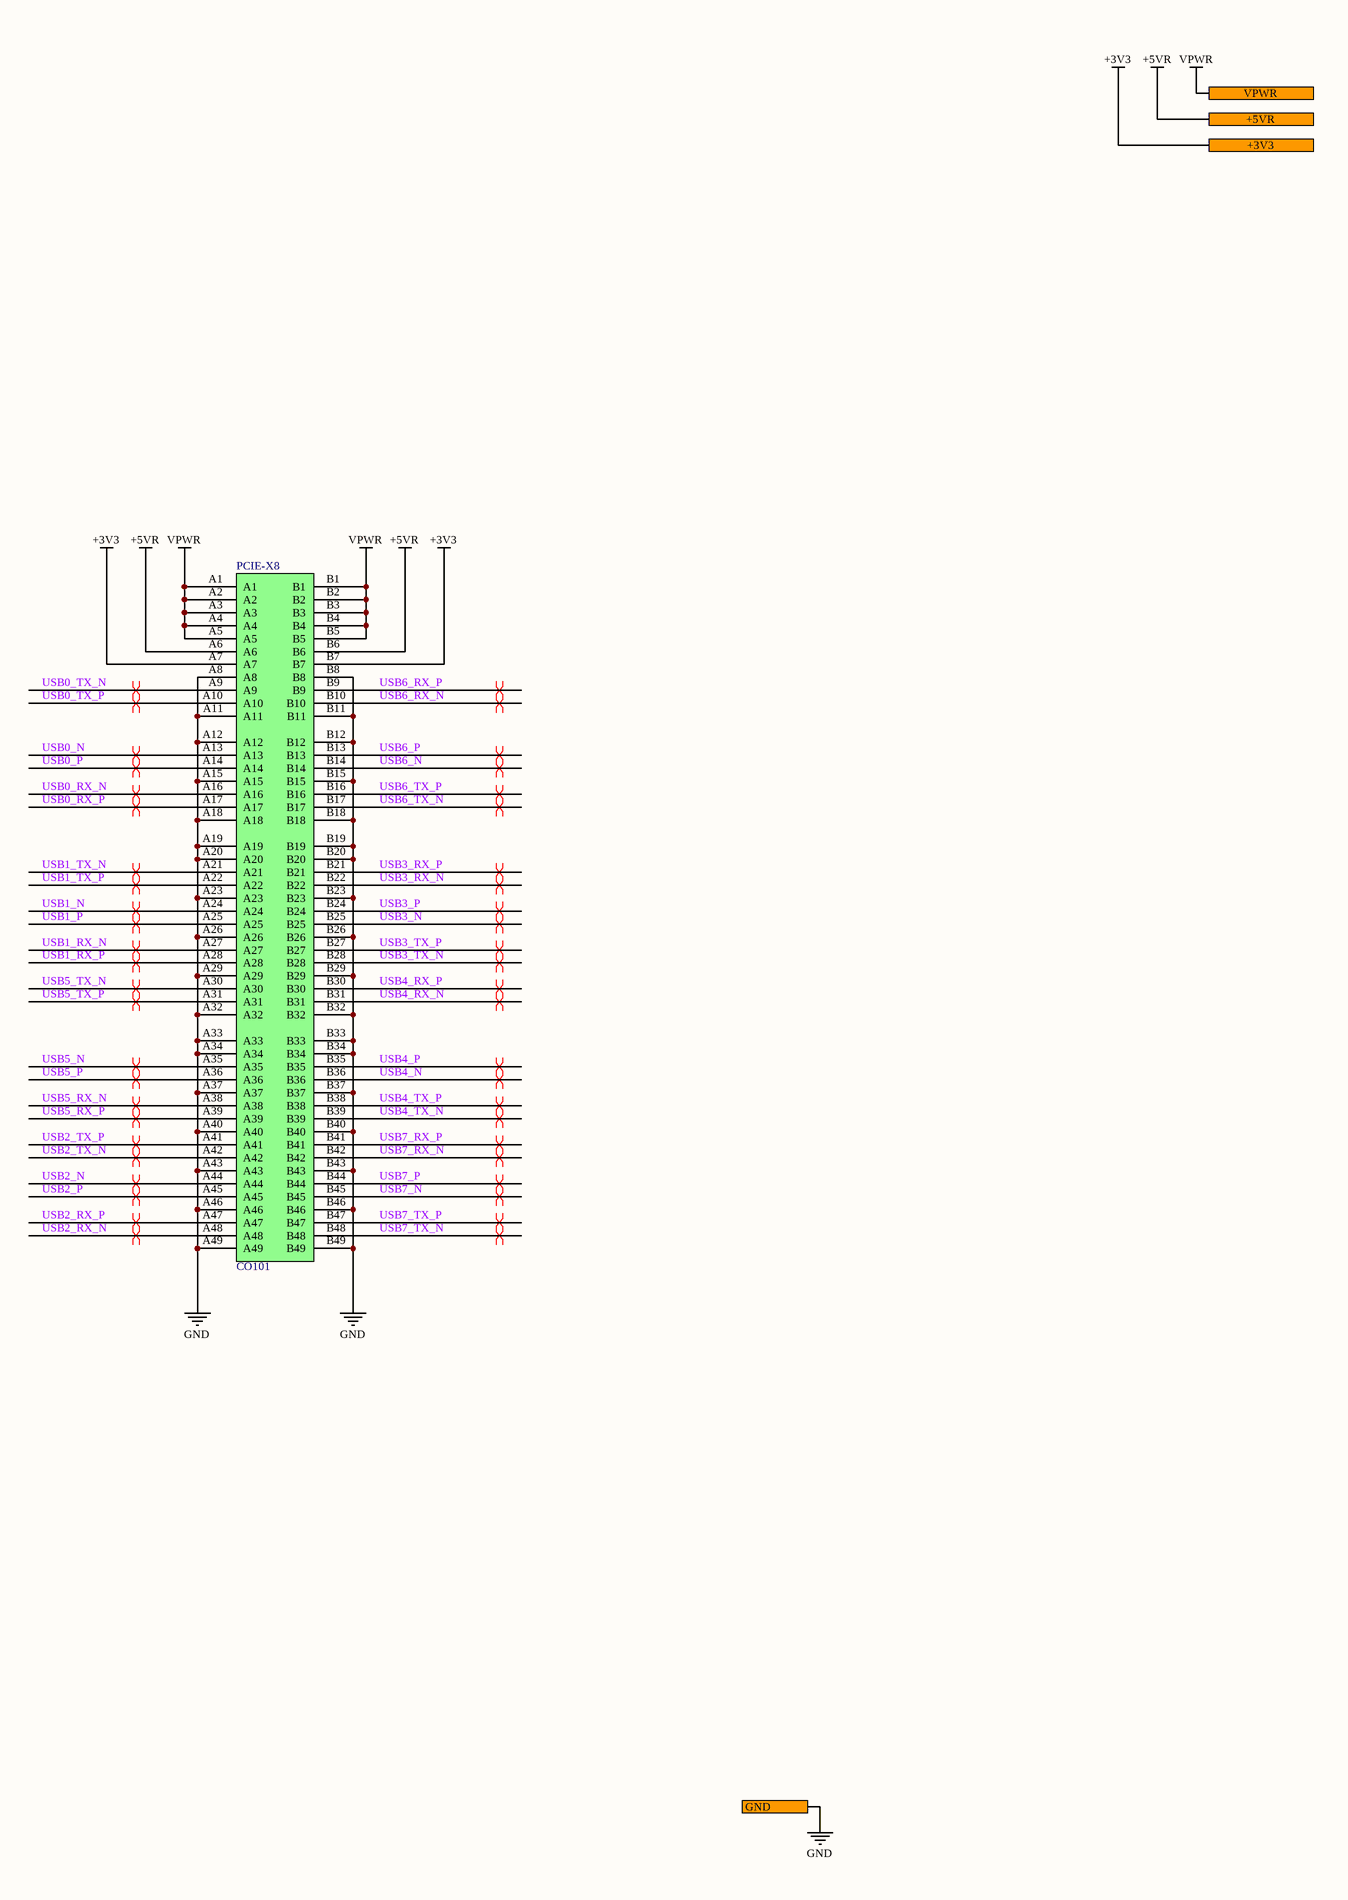
[diagram p13: 201_ConnectionPart2-Part1.SchDoc, right]

### Parts
CO101  PCIE-X8  [PCIE-X8-PCB-BASIC]

### Ports
+3V3, +5VR, GND, USB0 (harness HU0), USB1 (harness HU1), USB2 (harness HU2), USB3 (harness HU3), USB4 (harness HU4), USB5 (harness HU5), USB6 (harness HU6), USB7 (harness HU7), VPWR

### Harnesses
HU0: USB0_5V, USB0_TX_P, USB0_TX_N, USB0_N, USB0_RX_P, USB0_RX_N, USB0_SEL, USB0_P, USB0_CC, USB0_SBU
HU5: USB5_5V, USB5_TX_P, USB5_TX_N, USB5_N, USB5_RX_P, USB5_RX_N, USB5_SEL, USB5_P, USB5_CC, USB5_SBU
HU4: USB4_5V, USB4_TX_P, USB4_TX_N, USB4_N, USB4_RX_P, USB4_RX_N, USB4_SEL, USB4_P, USB4_CC, USB4_SBU
HU1: USB1_5V, USB1_TX_P, USB1_TX_N, USB1_N, USB1_RX_P, USB1_RX_N, USB1_SEL, USB1_P, USB1_CC, USB1_SBU
HU7: USB7_5V, USB7_TX_P, USB7_TX_N, USB7_N, USB7_RX_P, USB7_RX_N, USB7_SEL, USB7_P, USB7_CC, USB7_SBU
HU6: USB6_5V, USB6_TX_P, USB6_TX_N, USB6_N, USB6_RX_P, USB6_RX_N, USB6_SEL, USB6_P, USB6_CC, USB6_SBU
HU3: USB3_5V, USB3_TX_P, USB3_TX_N, USB3_N, USB3_RX_P, USB3_RX_N, USB3_SEL, USB3_P, USB3_CC, USB3_SBU
HU2: USB2_5V, USB2_TX_P, USB2_TX_N, USB2_N, USB2_RX_P, USB2_RX_N, USB2_SEL, USB2_P, USB2_CC, USB2_SBU

### Nets
+3V3: CO101.A7 CO101.B7 ; port +3V3
+5VR: CO101.A6 CO101.B6 ; port +5VR
GND: CO101.A8 CO101.A11 CO101.A12 CO101.A15 CO101.A18 CO101.A19 CO101.A20 CO101.A23 CO101.A26 CO101.A29 CO101.A32 CO101.A33 CO101.A34 CO101.A37 CO101.A40 CO101.A43 CO101.A46 CO101.A49 CO101.B8 CO101.B11 CO101.B12 CO101.B15 CO101.B18 CO101.B19 CO101.B20 CO101.B23 CO101.B26 CO101.B29 CO101.B32 CO101.B33 CO101.B34 CO101.B37 CO101.B40 CO101.B43 CO101.B46 CO101.B49 ; port GND
VPWR: CO101.A1 CO101.A2 CO101.A3 CO101.A4 CO101.A5 CO101.B1 CO101.B2 CO101.B3 CO101.B4 CO101.B5 ; port VPWR
U0_SEL: port USB0.USB0_SEL
U1_SEL: port USB1.USB1_SEL
U2_SEL: port USB2.USB2_SEL
U3_SEL: port USB3.USB3_SEL
U4_SEL: port USB4.USB4_SEL
U5_SEL: port USB5.USB5_SEL
U6_SEL: port USB6.USB6_SEL
U7_SEL: port USB7.USB7_SEL
USB0_5V: port USB0.USB0_5V
USB0_CC1: port USB0.USB0_CC
USB0_CC2: port USB0.USB0_SBU
USB0_N: CO101.A13 ; port USB0.USB0_N
USB0_P: CO101.A14 ; port USB0.USB0_P
USB0_RX_N: CO101.A16 ; port USB0.USB0_RX_N
USB0_RX_P: CO101.A17 ; port USB0.USB0_RX_P
USB0_TX_N: CO101.A9 ; port USB0.USB0_TX_N
USB0_TX_P: CO101.A10 ; port USB0.USB0_TX_P
USB1_5V: port USB1.USB1_5V
USB1_CC1: port USB1.USB1_CC
USB1_CC2: port USB1.USB1_SBU
USB1_N: CO101.A24 ; port USB1.USB1_N
USB1_P: CO101.A25 ; port USB1.USB1_P
USB1_RX_N: CO101.A27 ; port USB1.USB1_RX_N
USB1_RX_P: CO101.A28 ; port USB1.USB1_RX_P
USB1_TX_N: CO101.A21 ; port USB1.USB1_TX_N
USB1_TX_P: CO101.A22 ; port USB1.USB1_TX_P
USB2_5V: port USB2.USB2_5V
USB2_CC1: port USB2.USB2_CC
USB2_CC2: port USB2.USB2_SBU
USB2_N: CO101.A44 ; port USB2.USB2_N
USB2_P: CO101.A45 ; port USB2.USB2_P
USB2_RX_N: CO101.A48 ; port USB2.USB2_RX_N
USB2_RX_P: CO101.A47 ; port USB2.USB2_RX_P
USB2_TX_N: CO101.A42 ; port USB2.USB2_TX_N
USB2_TX_P: CO101.A41 ; port USB2.USB2_TX_P
USB3_5V: port USB3.USB3_5V
USB3_CC1: port USB3.USB3_CC
USB3_CC2: port USB3.USB3_SBU
USB3_N: CO101.B25 ; port USB3.USB3_N
USB3_P: CO101.B24 ; port USB3.USB3_P
USB3_RX_N: CO101.B22 ; port USB3.USB3_RX_N
USB3_RX_P: CO101.B21 ; port USB3.USB3_RX_P
USB3_TX_N: CO101.B28 ; port USB3.USB3_TX_N
USB3_TX_P: CO101.B27 ; port USB3.USB3_TX_P
USB4_5V: port USB4.USB4_5V
USB4_CC1: port USB4.USB4_CC
USB4_CC2: port USB4.USB4_SBU
USB4_N: CO101.B36 ; port USB4.USB4_N
USB4_P: CO101.B35 ; port USB4.USB4_P
USB4_RX_N: CO101.B31 ; port USB4.USB4_RX_N
USB4_RX_P: CO101.B30 ; port USB4.USB4_RX_P
USB4_TX_N: CO101.B39 ; port USB4.USB4_TX_N
USB4_TX_P: CO101.B38 ; port USB4.USB4_TX_P
USB5_5V: port USB5.USB5_5V
USB5_CC1: port USB5.USB5_CC
USB5_CC2: port USB5.USB5_SBU
USB5_N: CO101.A35 ; port USB5.USB5_N
USB5_P: CO101.A36 ; port USB5.USB5_P
USB5_RX_N: CO101.A38 ; port USB5.USB5_RX_N
USB5_RX_P: CO101.A39 ; port USB5.USB5_RX_P
USB5_TX_N: CO101.A30 ; port USB5.USB5_TX_N
USB5_TX_P: CO101.A31 ; port USB5.USB5_TX_P
USB6_5V: port USB6.USB6_5V
USB6_CC1: port USB6.USB6_CC
USB6_CC2: port USB6.USB6_SBU
USB6_N: CO101.B14 ; port USB6.USB6_N
USB6_P: CO101.B13 ; port USB6.USB6_P
USB6_RX_N: CO101.B10 ; port USB6.USB6_RX_N
USB6_RX_P: CO101.B9 ; port USB6.USB6_RX_P
USB6_TX_N: CO101.B17 ; port USB6.USB6_TX_N
USB6_TX_P: CO101.B16 ; port USB6.USB6_TX_P
USB7_5V: port USB7.USB7_5V
USB7_CC1: port USB7.USB7_CC
USB7_CC2: port USB7.USB7_SBU
USB7_N: CO101.B45 ; port USB7.USB7_N
USB7_P: CO101.B44 ; port USB7.USB7_P
USB7_RX_N: CO101.B42 ; port USB7.USB7_RX_N
USB7_RX_P: CO101.B41 ; port USB7.USB7_RX_P
USB7_TX_N: CO101.B48 ; port USB7.USB7_TX_N
USB7_TX_P: CO101.B47 ; port USB7.USB7_TX_P

### Layout directives
differential pair; differential pair class USB3: USB0_N, USB0_P, USB0_RX_N, USB0_RX_P, USB0_TX_N, USB0_TX_P, USB1_N, USB1_P, USB1_RX_N, USB1_RX_P, USB1_TX_N, USB1_TX_P, USB2_N, USB2_P, USB2_RX_N, USB2_RX_P, USB2_TX_N, USB2_TX_P, USB3_N, USB3_P, USB3_RX_N, USB3_RX_P, USB3_TX_N, USB3_TX_P, USB4_N, USB4_P, USB4_RX_N, USB4_RX_P, USB4_TX_N, USB4_TX_P, USB5_N, USB5_P, USB5_RX_N, USB5_RX_P, USB5_TX_N, USB5_TX_P, USB6_N, USB6_P, USB6_RX_N, USB6_RX_P, USB6_TX_N, USB6_TX_P, USB7_N, USB7_P, USB7_RX_N, USB7_RX_P, USB7_TX_N, USB7_TX_P

### Notes on the sheet
- Title
- Size:
- Date:
- File:
- A2
- Number:
- Time:
- Revision:
- Sheet
- of

### Library data of the parts
CO101 = CO0052: PCIE GEN4-X8, Male; Part Number: CO0052; ID: 52; RefVal: PCIE-X8